# EAGLE design base_pcb_328 (EAGLE 7.2.0)

## Sheet 1 of 3
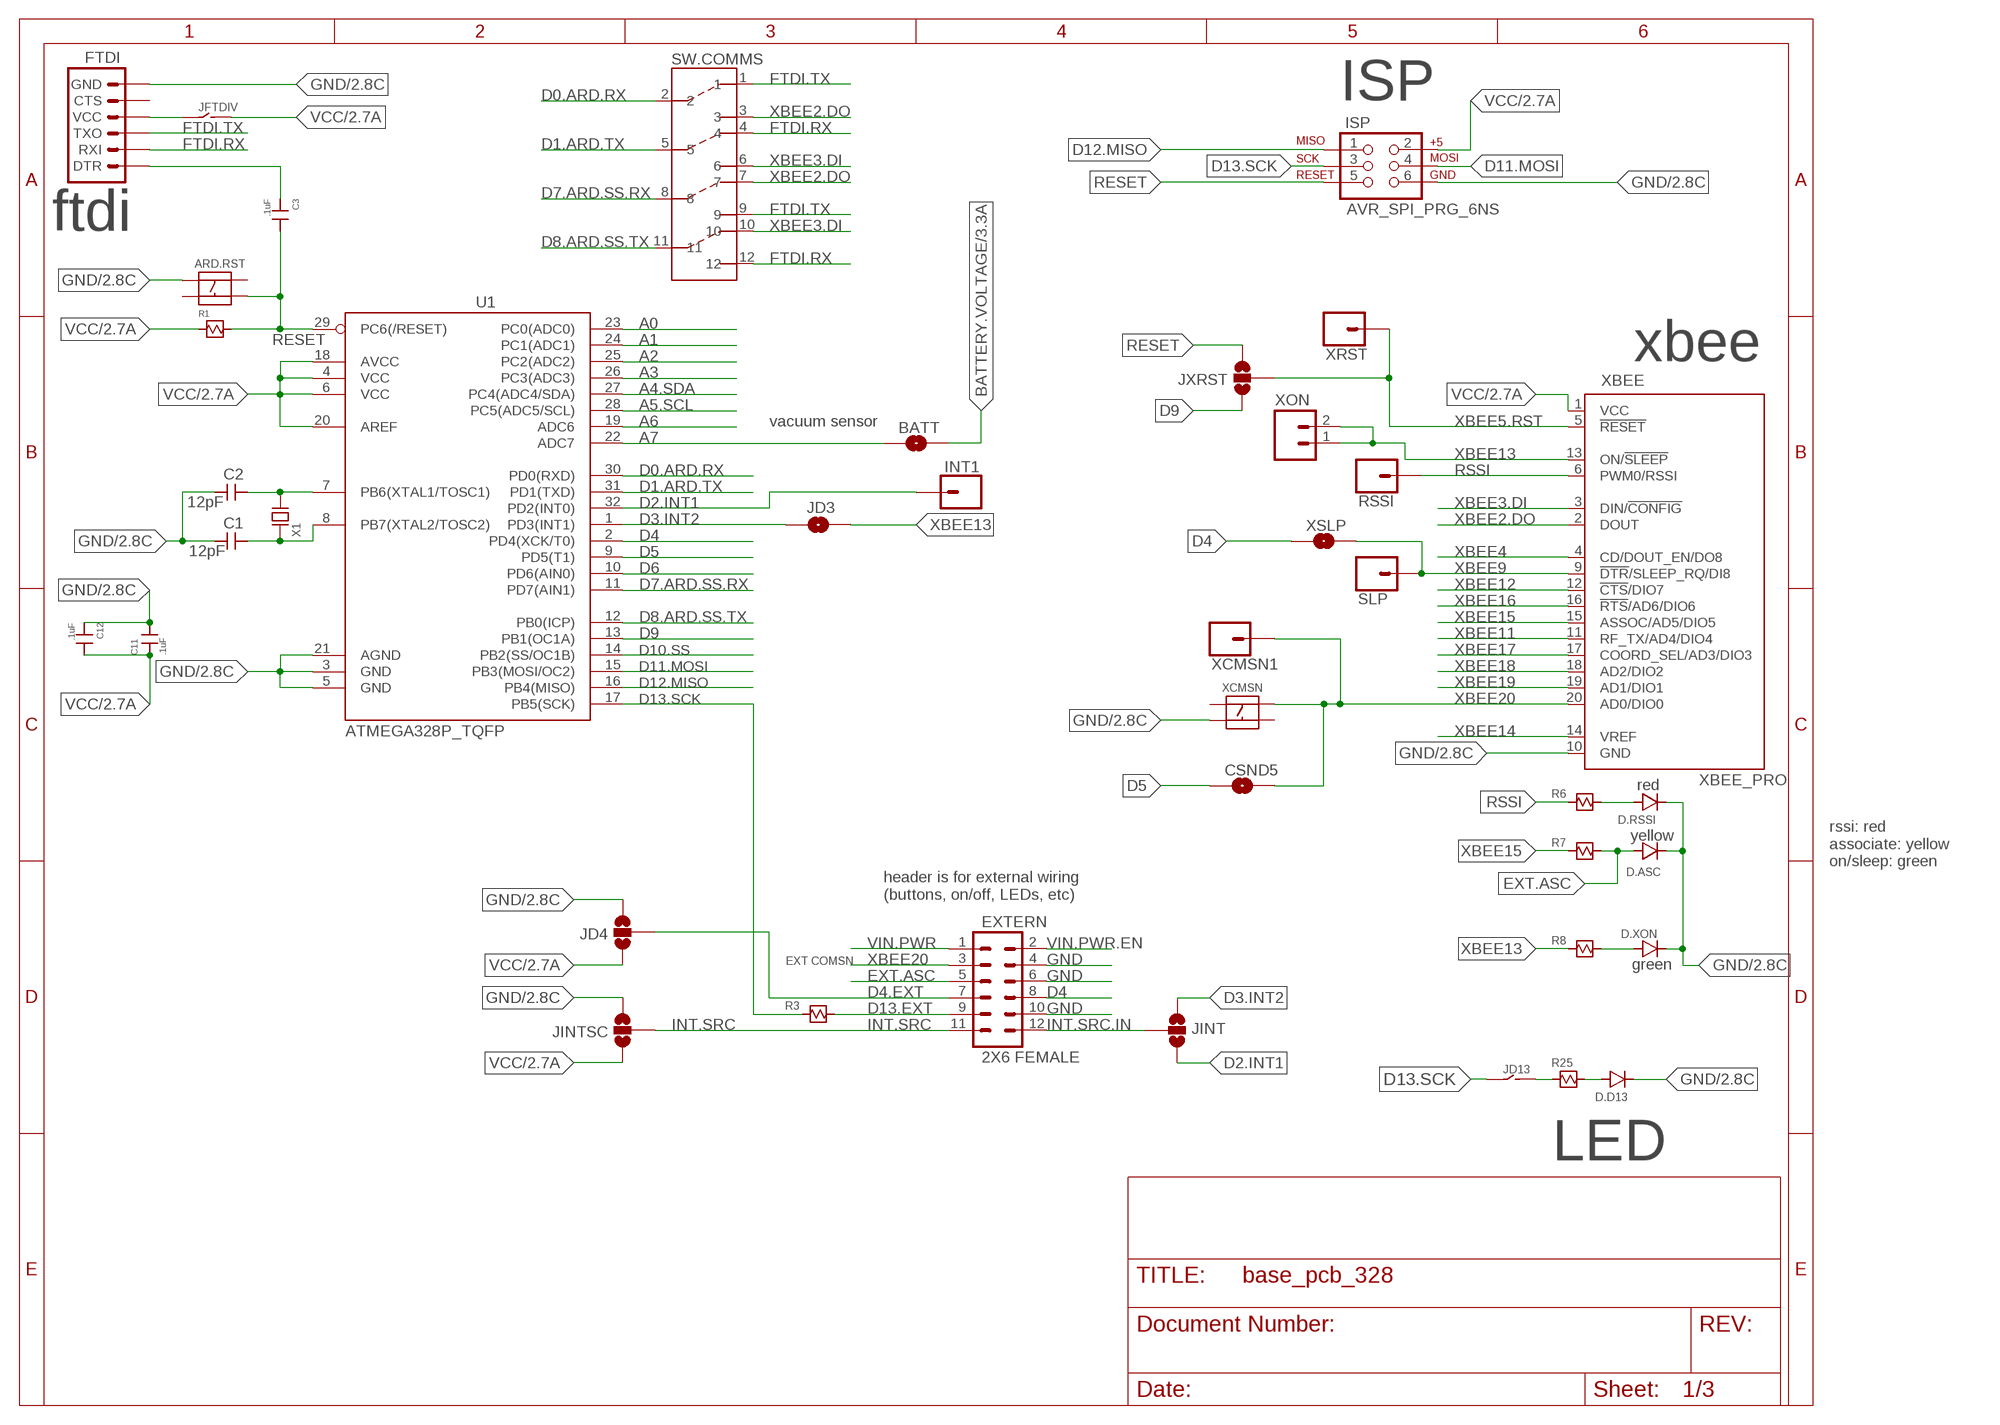
[diagram p0: schematic, sheet 1]

### Parts
ARD.RST  C&K_PUSHBUTTON_SMALL_MOM_SPST_SMD  [C&K_PUSHBUTTON_MOM_SMALL_SPST_SMD]
BATT  JUMPER-PAD-2-NOYES_SILK  [PAD-JUMPER-2-NO_YES_SILK]
C1  12pF  0603_CAPACITOR  [0603_CAPACITOR]
C2  12pF  0603_CAPACITOR  [0603_CAPACITOR]
C3  .1uF  0603_CAPACITOR  [0603_CAPACITOR]
C11  .1uF  0402_CAPACITOR  [0402_CAPACITOR]
C12  .1uF  0402_CAPACITOR  [0402_CAPACITOR]
CSND5  JUMPER-PAD-2-NOYES_SILK  [PAD-JUMPER-2-NO_YES_SILK]
D.ASC  0603_LED  [0603_LED]
D.D13  0603_LED  [0603_LED]
D.RSSI  0603_LED  [0603_LED]
D.XON  0603_LED  [0603_LED]
EXTERN  2X6 FEMALE  M06X2PTH_FEMALE  [2X6]
FTDI  ARDUINO_SERIAL_PROGRAMPTH  [1X06]
INT1  M01PTH  [1X01]
ISP  AVR_SPI_PRG_6NS  [2X3-NS]
JD3  JUMPER-PAD-2-NOYES_SILK  [PAD-JUMPER-2-NO_YES_SILK]
JD4  JUMPER-PAD-3-NOYES_SILK  [PAD-JUMPER-3-NO_YES_SILK]
JD13  JUMPER_2WAY_.1"_TH  [JUMPER_2WAY_.1"_TH]
JFTDIV  JUMPER_2WAY_.1"_TH  [JUMPER_2WAY_.1"_TH]
JINT  JUMPER-PAD-3-NOYES_SILK  [PAD-JUMPER-3-NO_YES_SILK]
JINTSC  JUMPER-PAD-3-NOYES_SILK  [PAD-JUMPER-3-NO_YES_SILK]
JXRST  JUMPER-PAD-3-NOYES_SILK  [PAD-JUMPER-3-NO_YES_SILK]
R1  0603_RESISTOR  [0603_RESISTOR]
R3  0603_RESISTOR  [0603_RESISTOR]
R6  0603_RESISTOR  [0603_RESISTOR]
R7  0603_RESISTOR  [0603_RESISTOR]
R8  0603_RESISTOR  [0603_RESISTOR]
R25  0603_RESISTOR  [0603_RESISTOR]
RSSI  M01PTH  [1X01]
SLP  M01PTH  [1X01]
SW.COMMS  COPAL_4PDT_SLIDE_SWITCH_TH  [COPAL_4PDT_SLIDE_SWITCH]
U1  ATMEGA328P_TQFP  [TQFP32-08]
X1  ABRACON_ABM3-16.000MHZ-D2Y-T_OSCILLATOR  [ABRACON_ABM3-16.000MHZ-D2Y-T_OSCILLATOR]
XBEE  XBEE_PRO  [XBEE_PRO]
XCMSN  C&K_PUSHBUTTON_SMALL_MOM_SPST_SMD  [C&K_PUSHBUTTON_MOM_SMALL_SPST_SMD]
XCMSN1  M01PTH  [1X01]
XON  M02PTH  [1X02]
XRST  M01PTH  [1X01]
XSLP  JUMPER-PAD-2-NOYES_SILK  [PAD-JUMPER-2-NO_YES_SILK]

### Nets
A0: U1.23(PC0(ADC0)) ; also sheet 2
A1: U1.24(PC1(ADC1)) ; also sheet 2
A2: U1.25(PC2(ADC2)) ; also sheet 2
A3: U1.26(PC3(ADC3)) ; also sheet 2
A4.SDA: U1.27(PC4(ADC4/SDA)) ; also sheet 2
A5.SCL: U1.28(PC5(ADC5/SCL)) ; also sheet 2
A6: U1.19(ADC6) ; also sheet 2
A7: BATT.1 U1.22(ADC7)
BATTERY.VOLTAGE: BATT.2 ; also sheet 3
D0.ARD.RX: SW.COMMS.2 U1.30(PD0(RXD))
D1.ARD.TX: SW.COMMS.5 U1.31(PD1(TXD))
D2.INT1: INT1.1 JINT.3 U1.32(PD2(INT0)) ; also sheet 2
D3.INT2: JD3.1 JINT.1 U1.1(PD3(INT1)) ; also sheet 2
D4: EXTERN.8 U1.2(PD4(XCK/T0)) XSLP.1 ; also sheet 2
D4.EXT: EXTERN.7 JD4.2
D5: CSND5.1 U1.9(PD5(T1)) ; also sheet 2
D6: U1.10(PD6(AIN0)) ; also sheet 2
D7.ARD.SS.RX: SW.COMMS.8 U1.11(PD7(AIN1))
D8.ARD.SS.TX: SW.COMMS.11 U1.12(PB0(ICP)) ; also sheet 2
D9: JXRST.1 U1.13(PB1(OC1A)) ; also sheet 2,3
D10.SS: U1.14(PB2(SS/OC1B)) ; also sheet 2
D11.MOSI: ISP.4 U1.15(PB3(MOSI/OC2)) ; also sheet 2
D12.MISO: ISP.1 U1.16(PB4(MISO)) ; also sheet 2
D13.EXT: EXTERN.9 R3.2
D13.SCK: ISP.3 JD13.P$1 R3.1 U1.17(PB5(SCK)) ; also sheet 2
EXT.ASC: D.ASC.1 EXTERN.5 R7.2
FTDI.RX: FTDI.2(RXI) SW.COMMS.4 SW.COMMS.12
FTDI.TX: FTDI.3(TXO) SW.COMMS.1 SW.COMMS.9
GND: ARD.RST.1 C1.2 C2.2 C11.2 C12.1 D.ASC.2 D.D13.2 D.RSSI.2 D.XON.2 EXTERN.4 EXTERN.6 EXTERN.10 FTDI.6(GND) ISP.6 JD4.3 JINTSC.3 U1.3(GND) U1.5(GND) U1.21(AGND) XBEE.10(GND) XCMSN.3 ; also sheet 2,3
INT.SRC: EXTERN.11 JINTSC.2
INT.SRC.IN: EXTERN.12 JINT.2
N$1: C2.1 U1.7(PB6(XTAL1/TOSC1)) X1.P$2
N$2: C1.1 U1.8(PB7(XTAL2/TOSC2)) X1.P$1
N$3: C3.1 FTDI.1(DTR)
N$5: D.D13.1 R25.2
N$6: JD13.P$2 R25.1
N$24: D.RSSI.1 R6.2
N$33: D.XON.1 R8.2
RESET: ARD.RST.4 C3.2 ISP.5 JXRST.3 R1.2 U1.29(PC6(/RESET))
RSSI: R6.1 RSSI.1 XBEE.6(PWM0/RSSI) ; also sheet 2
VCC: C11.1 C12.2 ISP.2 JD4.1 JFTDIV.P$2 JINTSC.1 R1.1 U1.4(VCC) U1.6(VCC) U1.18(AVCC) U1.20(AREF) XBEE.1(VCC) ; also sheet 2,3
VCC.FTDI: FTDI.4(VCC) JFTDIV.P$1
VIN.PWR: EXTERN.1 ; also sheet 2,3
VIN.PWR.EN: EXTERN.2 ; also sheet 3
XBEE2.DO: SW.COMMS.3 SW.COMMS.7 XBEE.2(DOUT) ; also sheet 2
XBEE3.DI: SW.COMMS.6 SW.COMMS.10 XBEE.3(DIN/!CONFIG) ; also sheet 2
XBEE4: XBEE.4(CD/DOUT_EN/DO8) ; also sheet 2
XBEE5.RST: JXRST.2 XBEE.5(!RESET) XRST.1 ; also sheet 2
XBEE9: SLP.1 XBEE.9(!DTR!/SLEEP_RQ/DI8) XSLP.2 ; also sheet 2
XBEE11: XBEE.11(RF_TX/AD4/DIO4) ; also sheet 2
XBEE12: XBEE.12(!CTS!/DIO7) ; also sheet 2
XBEE13: JD3.2 R8.1 XBEE.13(ON/!SLEEP) XON.1 XON.2 ; also sheet 2
XBEE14: XBEE.14(VREF) ; also sheet 2
XBEE15: R7.1 XBEE.15(ASSOC/AD5/DIO5) ; also sheet 2
XBEE16: XBEE.16(!RTS!/AD6/DIO6) ; also sheet 2
XBEE17: XBEE.17(COORD_SEL/AD3/DIO3) ; also sheet 2
XBEE18: XBEE.18(AD2/DIO2) ; also sheet 2
XBEE19: XBEE.19(AD1/DIO1) ; also sheet 2
XBEE20: CSND5.2 EXTERN.3 XBEE.20(AD0/DIO0) XCMSN1.1 XCMSN.2 ; also sheet 2
Unconnected: ARD.RST.2 ARD.RST.3 FTDI.5(CTS) XCMSN.1 XCMSN.4

### Notes on the sheet
- ISP
- ftdi
- xbee
- vacuum sensor
- red
- yellow
- rssi: red
  associate: yellow
  on/sleep: green
- header is for external wiring
  (buttons, on/off, LEDs, etc)
- EXT COMSN
- green
- LED

## Sheet 2 of 3
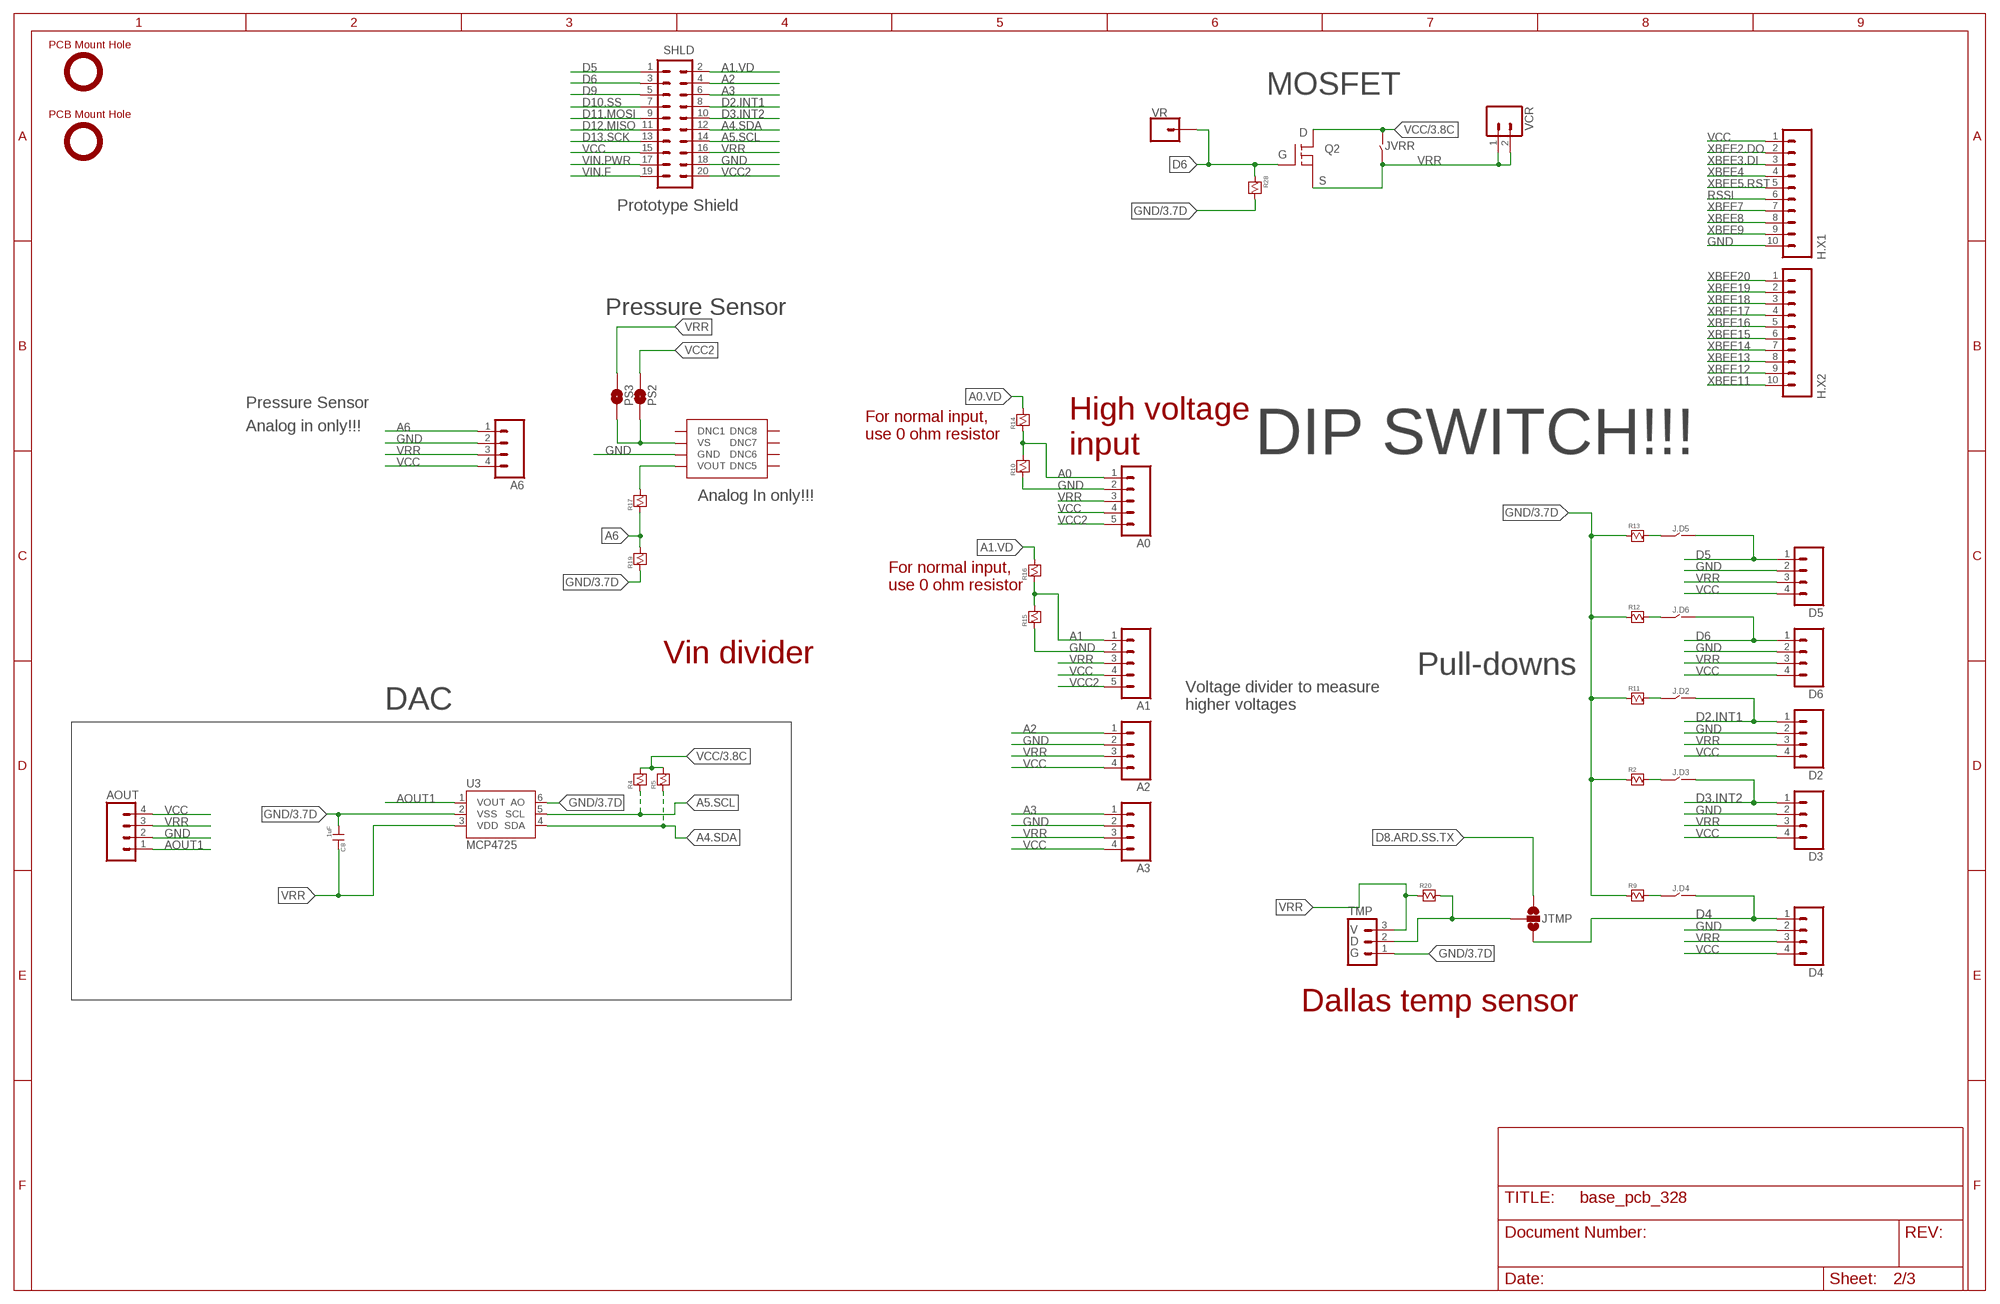
[diagram p1: schematic, sheet 2]

### Parts
A0  M05PTH  [1X05]
A1  M05PTH  [1X05]
A2  M04PTH  [1X04]
A3  M04PTH  [1X04]
A6  M04PTH  [1X04]
AOUT  M04PTH  [1X04]
C8  .1uF  0603_CAPACITOR  [0603_CAPACITOR]
D2  M04PTH  [1X04]
D3  M04PTH  [1X04]
D4  M04PTH  [1X04]
D5  M04PTH  [1X04]
D6  M04PTH  [1X04]
H.X1  M10NO_SILK_PTH_FEMALE  [1X10_NO_SILK]
H.X2  M10NO_SILK_PTH_FEMALE  [1X10_NO_SILK]
J.D2  JUMPER_2WAY_.1"_TH  [JUMPER_2WAY_.1"_TH]
J.D3  JUMPER_2WAY_.1"_TH  [JUMPER_2WAY_.1"_TH]
J.D4  JUMPER_2WAY_.1"_TH  [JUMPER_2WAY_.1"_TH]
J.D5  JUMPER_2WAY_.1"_TH  [JUMPER_2WAY_.1"_TH]
J.D6  JUMPER_2WAY_.1"_TH  [JUMPER_2WAY_.1"_TH]
JTMP  JUMPER-PAD-3-NOYES_SILK  [PAD-JUMPER-3-NO_YES_SILK]
JVRR  JUMPER_2WAY_.1"_TH  [JUMPER_2WAY_.1"_TH]
PS2  JUMPER-PAD-2-NOYES_SILK  [PAD-JUMPER-2-NO_YES_SILK]
PS3  JUMPER-PAD-2-NOYES_SILK  [PAD-JUMPER-2-NO_YES_SILK]
Q2  INFINEON_MOSFET_NCH  [INFINEON_MOSFET_NCH_SMD]
R2  0603_RESISTOR  [0603_RESISTOR]
R4  0603_RESISTOR  [0603_RESISTOR]
R5  0603_RESISTOR  [0603_RESISTOR]
R9  0603_RESISTOR  [0603_RESISTOR]
R10  0603_RESISTOR  [0603_RESISTOR]
R11  0603_RESISTOR  [0603_RESISTOR]
R12  0603_RESISTOR  [0603_RESISTOR]
R13  0603_RESISTOR  [0603_RESISTOR]
R14  0603_RESISTOR  [0603_RESISTOR]
R15  0603_RESISTOR  [0603_RESISTOR]
R16  0603_RESISTOR  [0603_RESISTOR]
R17  0603_RESISTOR  [0603_RESISTOR]
R19  0603_RESISTOR  [0603_RESISTOR]
R20  0603_RESISTOR  [0603_RESISTOR]
R28  0603_RESISTOR  [0603_RESISTOR]
SHLD  M10X2  [2X10]
TMP  M03PTH  [1X03]
U3  MCP4725  MCP4725SOT-23  [SOT23-6]
U$9  MPXV6115VC6U  [MPXV6115VC6U]
U$13  PCB_HOLE  [PCB_HOLE]
U$14  PCB_HOLE  [PCB_HOLE]
VCR  M02PTH  [1X02]
VR  M01PTH  [1X01]

### Nets
A0: A0.1 R10.2 R14.1 ; also sheet 1
A0.VD: R14.2 ; also sheet 3
A1: A1.1 R15.2 R16.1 ; also sheet 1
A1.VD: R16.2 SHLD.2
A2: A2.1 SHLD.4 ; also sheet 1
A3: A3.1 SHLD.6 ; also sheet 1
A4.SDA: R5.1 SHLD.12 U3.4(SDA) ; also sheet 1
A5.SCL: R4.1 SHLD.14 U3.5(SCL) ; also sheet 1
A6: A6.1 R17.1 R19.2 ; also sheet 1
A6.IN: R17.2 U$9.4(VOUT)
AOUT1: AOUT.1 U3.1(VOUT)
D2.INT1: D2.1 J.D2.P$2 SHLD.8 ; also sheet 1
D3.INT2: D3.1 J.D3.P$2 SHLD.10 ; also sheet 1
D4: D4.1 J.D4.P$2 JTMP.3 ; also sheet 1
D5: D5.1 J.D5.P$2 SHLD.1 ; also sheet 1
D6: D6.1 J.D6.P$2 Q2.G R28.1 SHLD.3 VR.1 ; also sheet 1
D8.ARD.SS.TX: JTMP.1 ; also sheet 1
D9: SHLD.5 ; also sheet 1,3
D10.SS: SHLD.7 ; also sheet 1
D11.MOSI: SHLD.9 ; also sheet 1
D12.MISO: SHLD.11 ; also sheet 1
D13.SCK: SHLD.13 ; also sheet 1
GND: A0.2 A1.2 A2.2 A3.2 A6.2 AOUT.2 C8.1 D2.2 D3.2 D4.2 D5.2 D6.2 H.X1.10 R2.1 R9.1 R10.1 R11.1 R12.1 R13.1 R15.1 R19.1 R28.2 SHLD.18 TMP.1 U3.2(VSS) U3.6(AO) U$9.3(GND) ; also sheet 1,3
N$7: JTMP.2 R20.2 TMP.2
N$13: PS2.1 PS3.1 U$9.2(VS)
N$20: J.D3.P$1 R2.2
N$21: J.D6.P$1 R12.2
N$22: J.D5.P$1 R13.2
N$25: J.D2.P$1 R11.2
N$34: J.D4.P$1 R9.2
RSSI: H.X1.6 ; also sheet 1
VCC: A0.4 A1.4 A2.4 A3.4 A6.4 AOUT.4 D2.4 D3.4 D4.4 D5.4 D6.4 H.X1.1 JVRR.P$2 Q2.D R4.2 R5.2 SHLD.15 ; also sheet 1,3
VCC2: A0.5 A1.5 PS2.2 SHLD.20 ; also sheet 3
VIN.F: SHLD.19 ; also sheet 3
VIN.PWR: SHLD.17 ; also sheet 1,3
VRR: A0.3 A1.3 A2.3 A3.3 A6.3 AOUT.3 C8.2 D2.3 D3.3 D4.3 D5.3 D6.3 JVRR.P$1 PS3.2 Q2.S R20.1 SHLD.16 TMP.3 U3.3(VDD) VCR.1 VCR.2 ; also sheet 3
XBEE2.DO: H.X1.2 ; also sheet 1
XBEE3.DI: H.X1.3 ; also sheet 1
XBEE4: H.X1.4 ; also sheet 1
XBEE5.RST: H.X1.5 ; also sheet 1
XBEE7: H.X1.7
XBEE8: H.X1.8
XBEE9: H.X1.9 ; also sheet 1
XBEE11: H.X2.10 ; also sheet 1
XBEE12: H.X2.9 ; also sheet 1
XBEE13: H.X2.8 ; also sheet 1
XBEE14: H.X2.7 ; also sheet 1
XBEE15: H.X2.6 ; also sheet 1
XBEE16: H.X2.5 ; also sheet 1
XBEE17: H.X2.4 ; also sheet 1
XBEE18: H.X2.3 ; also sheet 1
XBEE19: H.X2.2 ; also sheet 1
XBEE20: H.X2.1 ; also sheet 1
Unconnected: U$9.1(DNC1) U$9.5(DNC5) U$9.6(DNC6) U$9.7(DNC7) U$9.8(DNC8)

### Notes on the sheet
- MOSFET
- Q2
- Prototype Shield
- Pressure Sensor
- Pressure Sensor
- Analog in only!!!
- For normal input, 
  use 0 ohm resistor
- High voltage 
  input
- DIP SWITCH!!!
- Analog In only!!!
- For normal input, 
  use 0 ohm resistor
- Vin divider
- Pull-downs
- DAC
- Voltage divider to measure 
  higher voltages
- V
- D
- G
- Dallas temp sensor

## Sheet 3 of 3
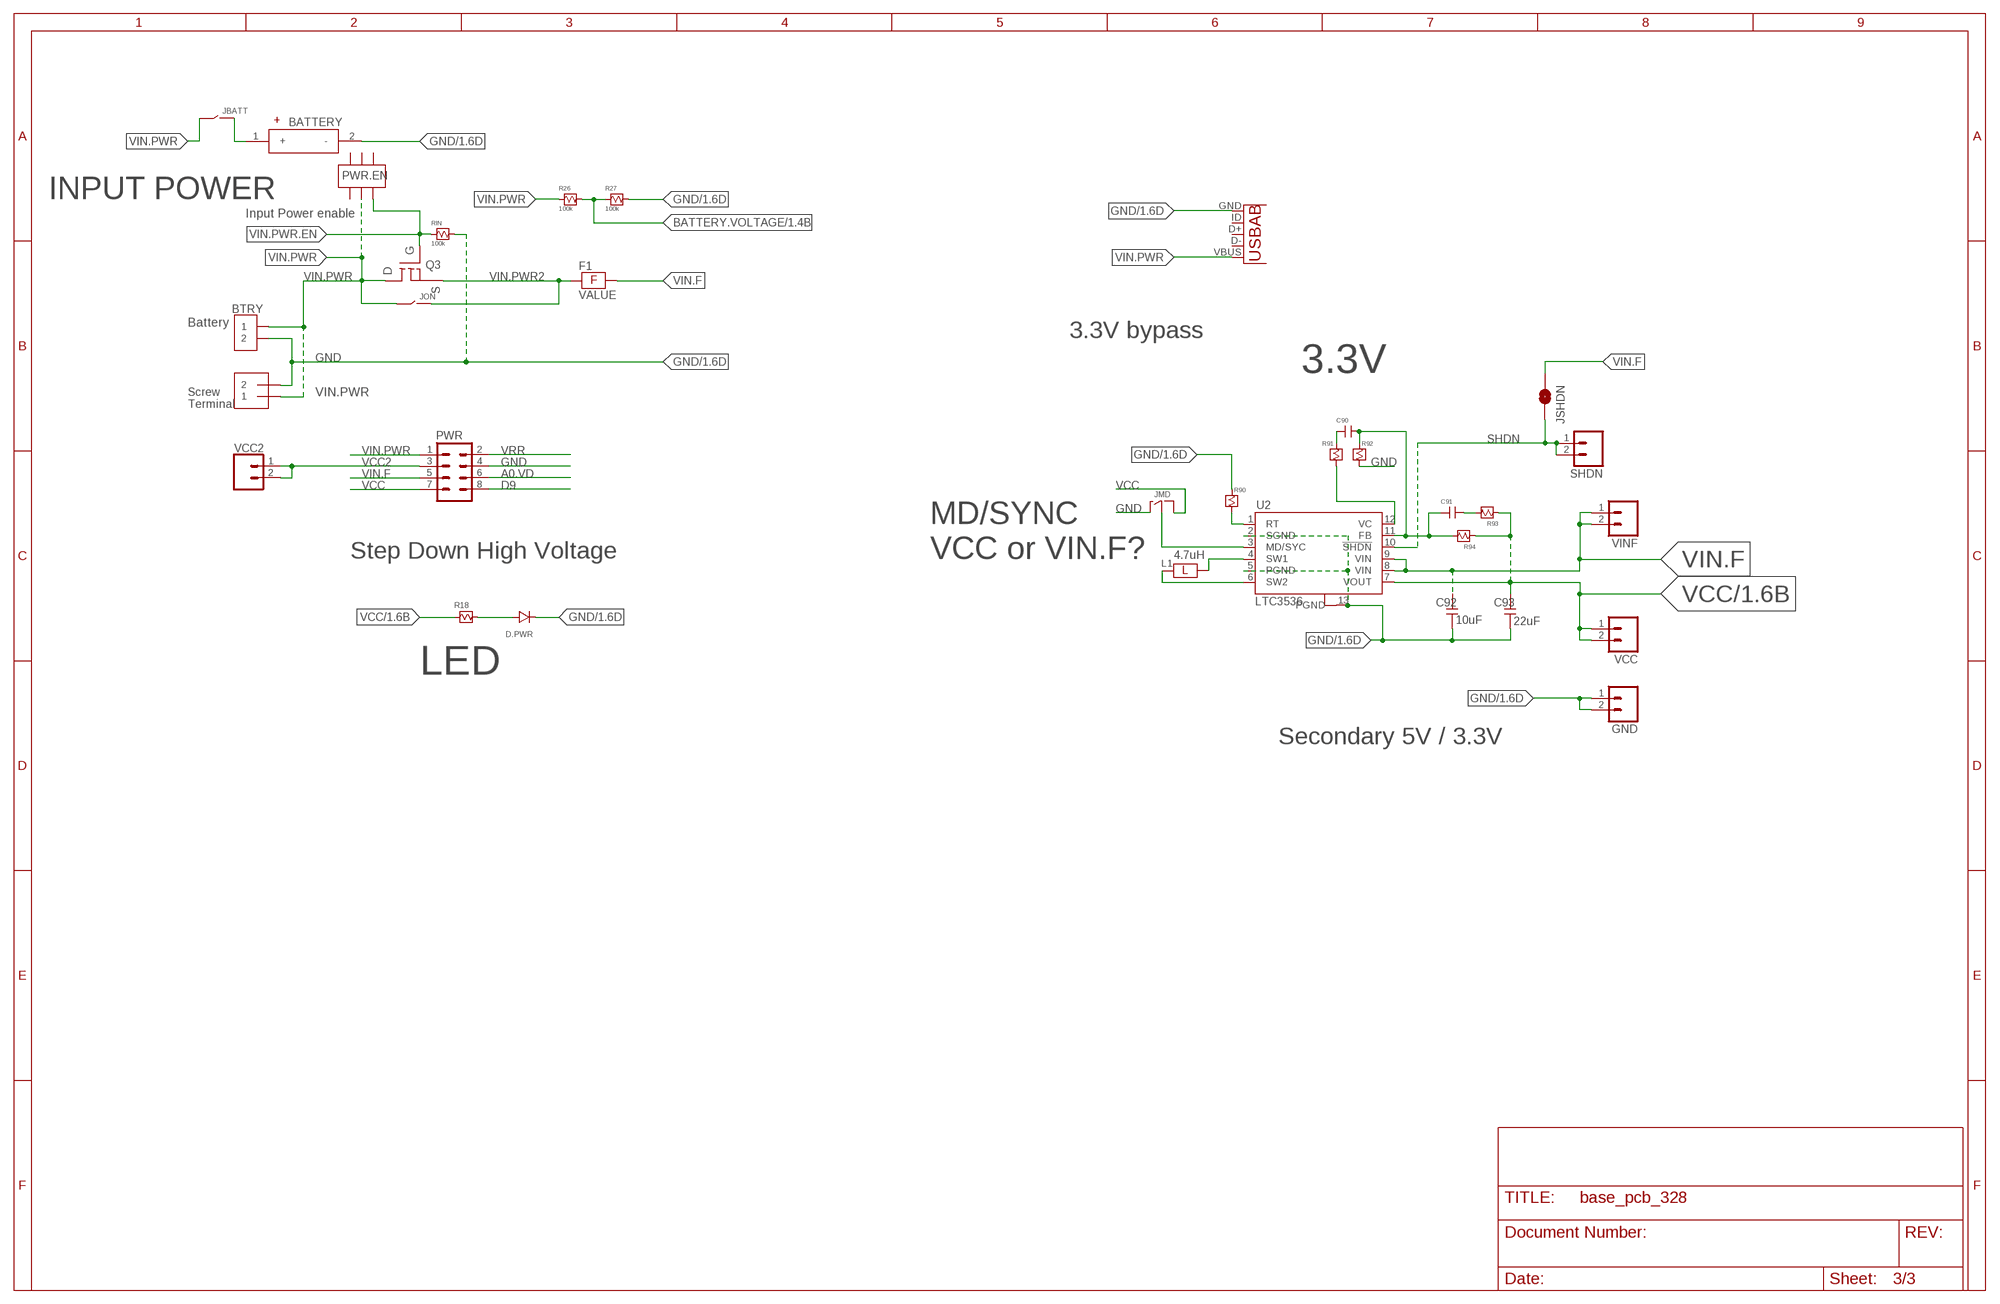
[diagram p2: schematic, sheet 3]

### Parts
5V  USB-AB  [USB-AB-MICRO-SMD]
BATTERY  BATTERY_HOLDER_18650  [BATTERY_HOLDER_18650]
BTRY  MOLEX_2PIN_LOCKING_TH  [MOLEX_2PIN_LOCKING_TH]
C90  0603_CAPACITOR  [0603_CAPACITOR]
C91  0603_CAPACITOR  [0603_CAPACITOR]
C92  10uF  0805_CAPACITOR  [0805_CAPACITOR]
C93  22uF  0805_CAPACITOR  [0805_CAPACITOR]
D.PWR  0603_LED  [0603_LED]
F1  PTC_FUSE_PTC_1206  [BEL_FUSE_PTC_FUSE_1206]
GND  M02PTH  [1X02]
INPUT.PWR  1X2-3.5MM  [1X2-3.5MM]
JBATT  JUMPER_2WAY_.1"_TH  [JUMPER_2WAY_.1"_TH]
JMD  JUMPER_3WAY_.1"_TH  [JUMPER_3WAY_.1"_TH]
JON  JUMPER_2WAY_.1"_TH  [JUMPER_2WAY_.1"_TH]
JSHDN  JUMPER-PAD-2-NOYES_SILK  [PAD-JUMPER-2-NO_YES_SILK]
L1  4.7uH  BOURNS_INDUCTOR_SMD  [BOURNS_INDUCTOR_SMD]
PWR  M04X2  [2X4]
PWR.EN  C&K_DPDT_SLIDE_SWITCH_SMD_HIDDEN_PADS  [C&K_SLIDE_SWITCH_DPDT_SMD_HIDDEN_PADS]
Q3  INFINEON_MOSFET_NCH  [INFINEON_MOSFET_NCH_SMD]
R18  0603_RESISTOR  [0603_RESISTOR]
R26  100k  0603_RESISTOR  [0603_RESISTOR]
R27  100k  0603_RESISTOR  [0603_RESISTOR]
R90  0603_RESISTOR  [0603_RESISTOR]
R91  0603_RESISTOR  [0603_RESISTOR]
R92  0603_RESISTOR  [0603_RESISTOR]
R93  0603_RESISTOR  [0603_RESISTOR]
R94  0603_RESISTOR  [0603_RESISTOR]
RIN  100k  0603_RESISTOR  [0603_RESISTOR]
SHDN  M02PTH  [1X02]
U2  LTC3536_ADJ_12PIN  [LTC3536_ADJ_12PIN]
VCC  M02PTH  [1X02]
VCC2  M02PTH  [1X02]
VINF  M02PTH  [1X02]

### Nets
A0.VD: PWR.6 ; also sheet 2
BATTERY.VOLTAGE: R26.2 R27.1 ; also sheet 1
D9: PWR.8 ; also sheet 1,2
GND: 5V.GND BATTERY.2(-) BTRY.2 C92.1 C93.1 D.PWR.2 GND.1 GND.2 INPUT.PWR.2 JMD.P$3 PWR.4 R27.2 R90.2 R92.1 RIN.2 U2.2(SGND) U2.5(PGND) U2.13(PGND) ; also sheet 1,2
N$4: BATTERY.1(+) JBATT.P$2
N$12: L1.P$2 U2.4(SW1)
N$16: D.PWR.1 R18.2
N$23: L1.P$1 U2.6(SW2)
N$26: R90.1 U2.1(RT)
N$27: C90.2 C91.1 R92.2 R94.2 U2.11(FB)
N$28: C90.1 R91.2
N$29: R91.1 U2.12(VC)
N$30: C91.2 R93.2
N$31: JMD.P$2 U2.3(MD/SYC)
SHDN: JSHDN.2 SHDN.1 SHDN.2 U2.10(!SHDN)
VCC: C93.2 JMD.P$1 PWR.7 R18.1 R93.1 R94.1 U2.7(VOUT) VCC.1 VCC.2 ; also sheet 1,2
VCC2: PWR.3 VCC2.1 VCC2.2 ; also sheet 2
VIN.F: C92.2 F1.P$2 JSHDN.1 PWR.5 U2.8(VIN) U2.9(VIN) VINF.1 VINF.2 ; also sheet 2
VIN.PWR: 5V.VBUS BTRY.1 INPUT.PWR.1 JBATT.P$1 JON.P$1 PWR.1 PWR.EN.5 Q3.D R26.1 ; also sheet 1,2
VIN.PWR2: F1.P$1 JON.P$2 Q3.S
VIN.PWR.EN: PWR.EN.4 Q3.G RIN.1 ; also sheet 1
VRR: PWR.2 ; also sheet 2
Unconnected: 5V.D+ 5V.D- 5V.ID(USBID) PWR.EN.1 PWR.EN.2 PWR.EN.3 PWR.EN.6

### Notes on the sheet
- BATTERY
- INPUT POWER
- Input Power enable
- Q3
- Battery
- 3.3V bypass
- 3.3V
- Screw
  Terminal
- Step Down High Voltage
- MD/SYNC
  VCC or VIN.F?
- 4.7uH
- LED
- Secondary 5V / 3.3V

## Library data of the parts
5V = SparkFun-Connectors:USB-AB: This is a USB AB connector that is compatible with USB OTG. i.e. this connector can serve as a host or device
A0 A1 = SparkFun-Connectors:M05: Header 5 Standard 5-pin 0.1" header. Use with straight break away headers (SKU : PRT-00116), right angle break away headers (PRT-00553), swiss pins (PRT-00743), machine pins (PRT-00117), and female headers (PRT-00115). Molex polarized connector foot print use with SKU : PRT-08230 with associated crimp pins and housings.
A2 A3 A6 AOUT D2-D6 = SparkFun-Connectors:M04: Header 4 Standard 4-pin 0.1" header. Use with straight break away headers (SKU : PRT-00116), right angle break away headers (PRT-00553), swiss pins (PRT-00743), machine pins (PRT-00117), and female headers (PRT-00115). Molex polarized connector foot print use with SKU : PRT-08231 with associated crimp pins and housings. 1MM SMD Version SKU: PRT-10208
ARD.RST XCMSN = Heath_control:C&K_PUSHBUTTON_SMALL_MOM_SPST_SMD: C&K: KMR742NG LFS Digikey: CKN10689CT-ND Description: SWITCH TACTILE SPST-NO 50MA 32V
BATT CSND5 JD3 JSHDN PS2 PS3 XSLP = SparkFun-Passives:JUMPER-PAD-2-NO
BATTERY = Heath_hardware:BATTERY_HOLDER_18650: Digikey: 36-1042-ND Keystone: 1042 Description: HOLDER BATTERY 1CELL 18650 SMD
BTRY = Heath_connectors:MOLEX_2PIN_LOCKING_TH: 2pin locking through hole
C1-C3 C8 C90 C91 = Heath_components:0603_CAPACITOR
C11 C12 = Heath_components:0402_CAPACITOR
C92 C93 = Heath_components:0805_CAPACITOR: 0805 samsung capacitor
D.ASC D.D13 D.PWR D.RSSI D.XON = Heath_components:0603_LED
EXTERN = SparkFun-Connectors:M06X2; PROD_ID: CONN-12423
F1 = Heath_circuit_protection:PTC_FUSE_PTC_1206: PTC resettable fuse, Bel Fuse, 1206 footprint
FTDI = SparkFun-Connectors:ARDUINO_SERIAL_PROGRAM: FTDI connector footprints
GND SHDN VCC VCC2 VCR VINF XON = SparkFun-Connectors:M02: Standard 2-pin 0.1" header. Use with - straight break away headers ( PRT-00116) - right angle break away headers (PRT-00553) - swiss pins (PRT-00743) - machine pins (PRT-00117) - female headers (PRT-00115) Molex polarized connector foot print use with: PRT-08233 with associated crimp pins and housings. 2.54_SCREWTERM for use with PRT-10571. 3.5mm Screw Terminal footprints for PRT-08084 5mm Screw Terminal footprints for use with PRT-08432
H.X1 H.X2 = SparkFun-Connectors:M10: Header 10 Standard 10-pin 0.1" header. Use with straight break away headers (SKU : PRT-00116), right angle break away headers (PRT-00553), swiss pins (PRT-00743), machine pins (PRT-00117), and female headers (PRT-00115).; PROD_ID: CONN-11563
INPUT.PWR = adafruit:1X2: 3.5mm Terminal block http://www.ladyada.net/library/pcb/eaglelibrary.html
INT1 RSSI SLP VR XCMSN1 XRST = SparkFun-Connectors:M01: Header 1 Standard 1-pin 0.1" header. Use with straight break away headers (SKU : PRT-00116), right angle break away headers (PRT-00553), swiss pins (PRT-00743), machine pins (PRT-00117), and female headers (PRT-00115).
ISP = SparkFun-Connectors:AVR_SPI_PRG_6: AVR ISP 6 Pin This is the reduced ISP connector for AVR programming. Common on Arduino. This footprint will take up less PCB space and can be used with a 10-pin to 6-pin adapter such as SKU: BOB-08508 **Special note about "TEST_POINT" package. The stop mask is on the top side, so if you want your programming test points to be on the bottom of your board, make sure to place this package on the bottom side of the board. This also ensure that the orientation to program from the bottom side will be correct.
J.D2-J.D6 JBATT JD13 JFTDIV JON JVRR = Heath_passives:JUMPER_2WAY_.1"_TH
JD4 JINT JINTSC JTMP JXRST = SparkFun-Passives:JUMPER-PAD-3-NO
JMD = Heath_passives:JUMPER_3WAY_.1"_TH
L1 = Heath_components:BOURNS_INDUCTOR_SMD: bourns inductor, 2.2uH - 10uH +, smd
PWR = SparkFun-Connectors:M04X2: .1" header, two rows of four.
PWR.EN = Heath_control:C&K_DPDT_SLIDE_SWITCH_SMD_HIDDEN_PADS: C&K slide switch (hidden pads) Digikey PN: CKN10723CT-ND C&K PN: JS202011JCQN
Q2 Q3 = Heath_components:INFINEON_MOSFET_NCH: Infineon:IRLML6344TRPBF Digikey: IRLML6344TRPBFCT-ND Description: MOSFET N-CH 30V 5A SOT23
R1-R20 R25-R28 R90-R94 RIN = Heath_components:0603_RESISTOR: 0603 footprint
SHLD = SparkFun-Connectors:M10X2: This was SPECIALLY designed to be used with our Graphic LCD Backpack. Be sure you want to use this! It is not only staggered on each line of header holes, but IT IS ALSO offset of the center point of the top and bottom lines by 5 mil. This causes the headers to lock into place on the "standard" footprint on the LCD screen. The extra squares on the tdocu layer are there simply to reference other pins (if you were to actually populate a longer header than ten long - this is what we do with the backpacks).
SW.COMMS = Heath_control:COPAL_4PDT_SLIDE_SWITCH_TH: Copal:MFS401N-2-Z Digikey: 563-1568-ND Description: SWITCH SLIDE 4PDT 300MA 30V
TMP = SparkFun-Connectors:M03: Header 3 Standard 3-pin 0.1" header. Use with straight break away headers (SKU : PRT-00116), right angle break away headers (PRT-00553), swiss pins (PRT-00743), machine pins (PRT-00117), and female headers (PRT-00115). Molex polarized connector foot print use with SKU : PRT-08232 with associated crimp pins and housings.
U1 = SparkFun-DigitalIC:ATMEGA328P_TQFP; PROD_ID: IC-09069
U2 = Heath_power:LTC3536_ADJ_12PIN: LTC3536
U3 = SparkFun-AnalogIC:MCP4725: Microchip 12-bit I2C DAC, SOT23-6; PROD_ID: IC-08886
U$9 = Heath_sensors:MPXV6115VC6U: NXP: MPXV6115VC6U Digikey: MPXV6115VC6U-ND Description: SENSOR PRESSURE VACUUM -16.68PSI
U$13 U$14 = Heath_hardware:PCB_HOLE
X1 = GREENSEA_Signal_Quality:ABRACON_ABM3-16.000MHZ-D2Y-T_OSCILLATOR: Abracon: ABM3-16.000MHZ-D2Y-T Digikey: 535-10638-1-ND
XBEE = Heath_boards:XBEE_PRO: xbee pro

## Board
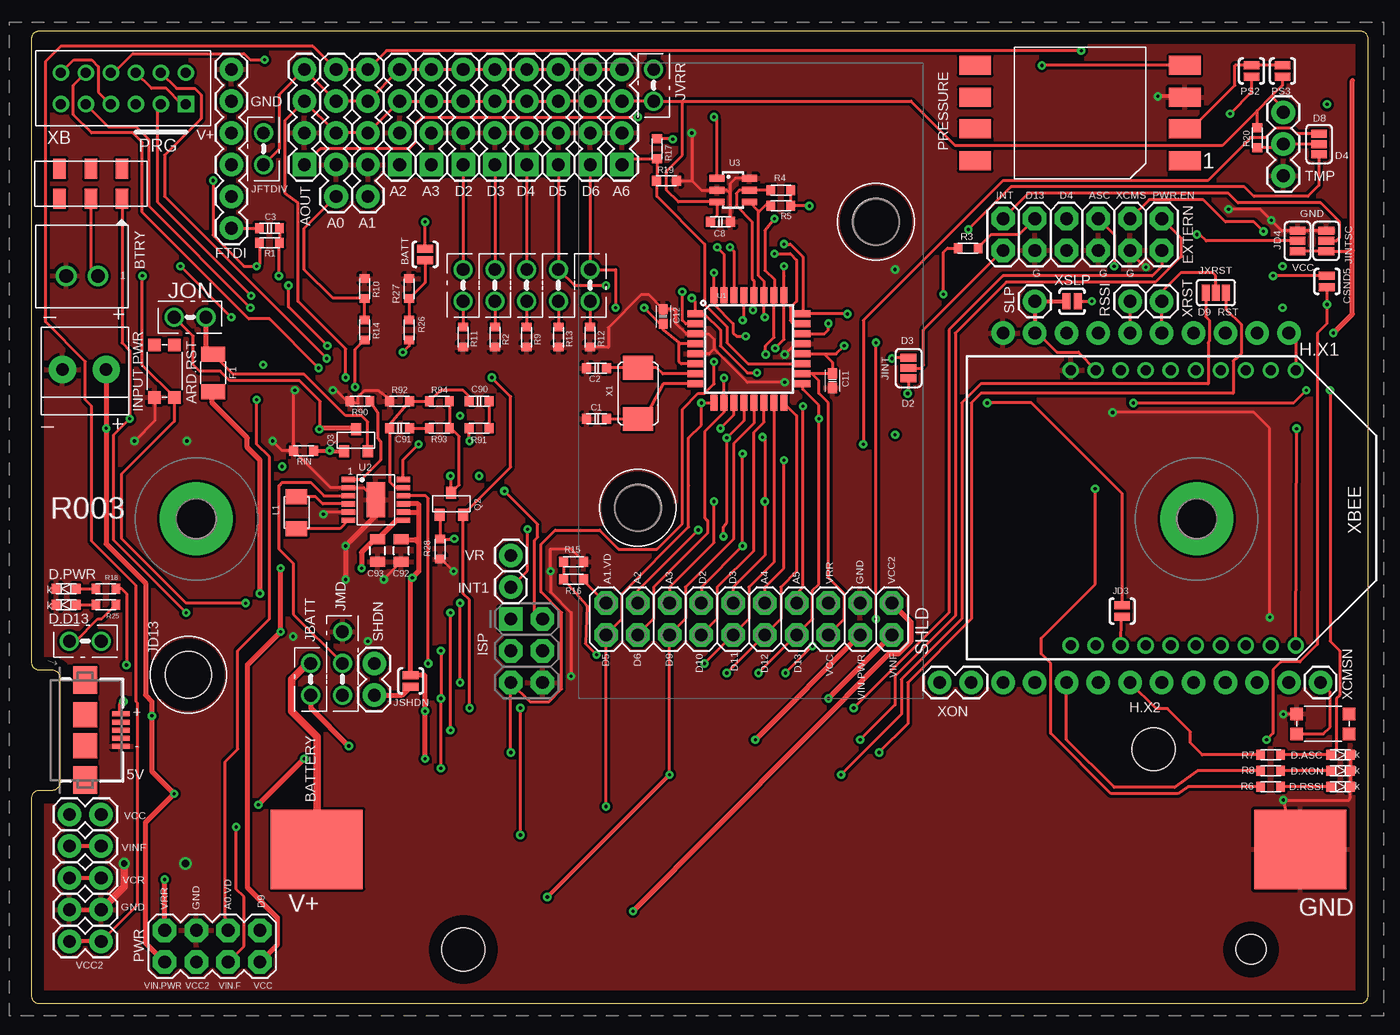
[diagram p3: board, top side]
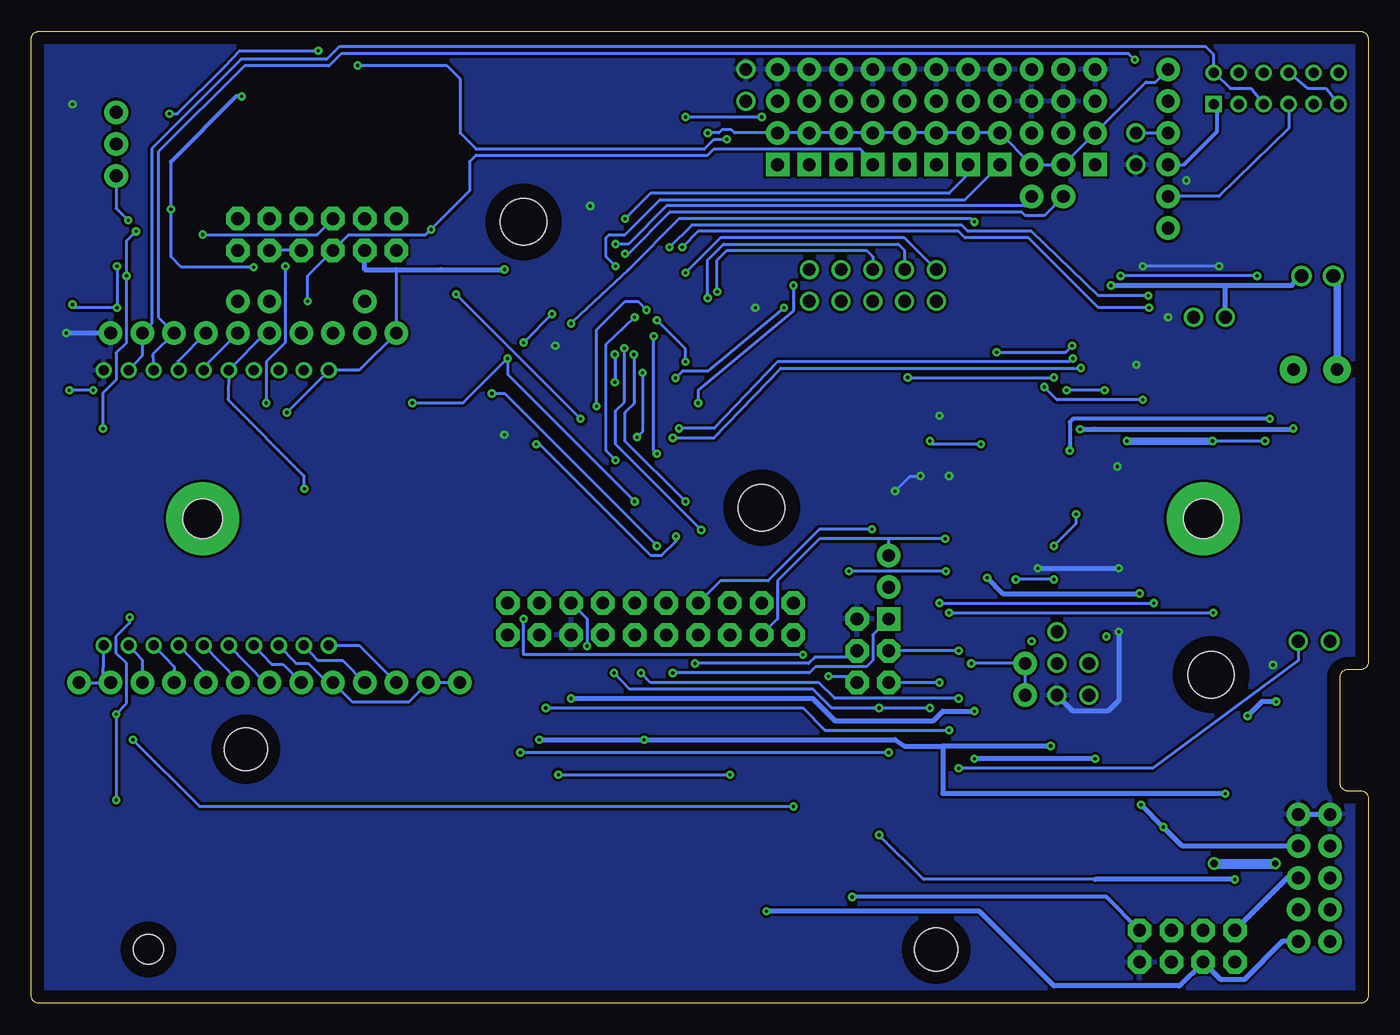
[diagram p4: board, bottom side, seen from below]

Size 106.93 x 77.72 mm. Coordinates in mm from the lower left corner, seen from the top.
Outline: 0,77.09 0,27.3 arc90 0.64,26.67 1.65,26.67 arc-90 2.29,26.04 2.29,17.65 arc-90 1.65,17.02 0.64,17.02 arc90 0,16.38 0,0.63 arc90 0.64,0 106.3,0 arc90 106.93,0.63 106.93,77.09 arc90 106.3,77.72 0.64,77.72 arc90 0,77.09
Copper layers (1*16): Top 0.035mm / dielectric 1.5mm / Bottom 0.035mm
Design rules "default *": minimum track width 10mil, minimum drill 24mil, track to track 8mil, track to pad 8mil, pad to pad 8mil, via to via 8mil, smd to smd 8mil, copper to edge 40mil, drill to drill 8mil, minimum pad ring 10mil, minimum via ring 8mil, stop-mask expansion 4mil, vias tented up to drill 11mil, thermal gap 10mil

### Footprints (pad centres in the part's own frame; a part is rotated, then mirrored left to right if it is on the bottom)
USB-AB-MICRO-SMD = smd 1.4 x 0.4: D+ 2.85,0; D- 2.85,0.65; GND 2.85,-1.3; ID 2.85,-0.65; VBUS 2.85,1.3 | smd 1.9 x 2: P$6 0,1.25; P$7 0,-1.25 | smd 1.9 x 2.2: P$8 0,4; P$9 0,-4
1X05 = drill 1.016 pad 1.88: 1 0,0; 2 2.54,0; 3 5.08,0; 4 7.62,0; 5 10.16,0
1X04 = drill 1.016 pad 1.88 square: 1 0,0 | drill 1.016 pad 1.88: 2 2.54,0; 3 5.08,0; 4 7.62,0
C&K_PUSHBUTTON_MOM_SMALL_SPST_SMD = smd 1 x 1: 1 -2.1,0.8; 2 2.1,0.8; 3 2.1,-0.8; 4 -2.1,-0.8
PAD-JUMPER-2-NO_YES_SILK = smd 0.635 x 1.27: 1 -0.45,0; 2 0.45,0
BATTERY_HOLDER_18650 = smd 7.34 x 6.35: 1 -39.33,0; 2 39.33,0 | hole 3.45: -27.6,-8; 27.6,8 | hole 2.39: 35.39,-8
MOLEX_2PIN_LOCKING_TH = drill 1.1: 1 1.27,0; 2 -1.27,0
0603_CAPACITOR = smd 0.7 x 0.8: 1 -0.8,0; 2 0.8,0
0402_CAPACITOR = smd 0.813 x 0.711: 1 -0.58,0; 2 0.58,0
0805_CAPACITOR = smd 0.8 x 1.2: 1 -0.9,0; 2 0.9,0
0603_LED = smd 0.7 x 0.8: 1 -0.8,0; 2 0.8,0
2X6 = drill 1.016 pad 1.88 octagon: 1 0,0; 2 0,2.54; 3 2.54,0; 4 2.54,2.54; 5 5.08,0; 6 5.08,2.54; 7 7.62,0; 8 7.62,2.54; 9 10.16,0; 10 10.16,2.54; 11 12.7,0; 12 12.7,2.54
BEL_FUSE_PTC_FUSE_1206 = smd 1.2 x 1.9: P$1 -1.5,0; P$2 1.5,0
1X06 = drill 1.016 pad 1.88: 1 0,0; 2 2.54,0; 3 5.08,0; 4 7.62,0; 5 10.16,0; 6 12.7,0
1X02 = drill 1.016 pad 1.88: 1 0,0; 2 2.54,0
1X10_NO_SILK = drill 1.016 pad 1.88: 1 0,0; 2 2.54,0; 3 5.08,0; 4 7.62,0; 5 10.16,0; 6 12.7,0; 7 15.24,0; 8 17.78,0; 9 20.32,0; 10 22.86,0
1X2-3.5MM = drill 1 pad 2.184: 1 1.8,0; 2 -1.7,0
1X01 = drill 1.016 pad 1.88: 1 0,0
2X3-NS = drill 1.016 pad 1.88 square: 1 -2.54,-1.27 | drill 1.016 pad 1.88 octagon: 2 -2.54,1.27; 3 0,-1.27; 4 0,1.27; 5 2.54,-1.27; 6 2.54,1.27
JUMPER_2WAY_.1"_TH = drill 1.016: P$1 -1.27,0; P$2 1.27,0
PAD-JUMPER-3-NO_YES_SILK = smd 0.635 x 1.27: 1 -0.813,0; 2 0,0; 3 0.813,0
JUMPER_3WAY_.1"_TH = drill 1.016: P$1 -2.54,0; P$2 0,0; P$3 2.54,0
BOURNS_INDUCTOR_SMD = smd 1.2 x 1.75: P$1 -1.275,0; P$2 1.275,0
2X4 = drill 1.016 pad 1.88 octagon: 1 -3.81,-1.27; 2 -3.81,1.27; 3 -1.27,-1.27; 4 -1.27,1.27; 5 1.27,-1.27; 6 1.27,1.27; 7 3.81,-1.27; 8 3.81,1.27
C&K_SLIDE_SWITCH_DPDT_SMD_HIDDEN_PADS = smd 1 x 1.6: 1 -2.5,1.2; 2 0,1.2; 3 2.5,1.2; 4 2.5,-1.2; 5 0,-1.2; 6 -2.5,-1.2
INFINEON_MOSFET_NCH_SMD = smd 0.802 x 0.972: D 0,0.885; G -0.95,-0.885; S 0.95,-0.885
0603_RESISTOR = smd 0.7 x 0.8: 1 -0.8,0; 2 0.8,0
2X10 = drill 1.016 pad 1.88 octagon: 1 -11.43,-1.27; 2 -11.43,1.27; 3 -8.89,-1.27; 4 -8.89,1.27; 5 -6.35,-1.27; 6 -6.35,1.27; 7 -3.81,-1.27; 8 -3.81,1.27; 9 -1.27,-1.27; 10 -1.27,1.27; 11 1.27,-1.27; 12 1.27,1.27; 13 3.81,-1.27; 14 3.81,1.27; 15 6.35,-1.27; 16 6.35,1.27; 17 8.89,-1.27; 18 8.89,1.27; 19 11.43,-1.27; 20 11.43,1.27
COPAL_4PDT_SLIDE_SWITCH = drill 0.8 square: 1 -5,1.25 | drill 0.8: 2 -3,1.25; 3 -1,1.25; 4 1,1.25; 5 3,1.25; 6 5,1.25; 7 -5,-1.25; 8 -3,-1.25; 9 -1,-1.25; 10 1,-1.25; 11 3,-1.25; 12 5,-1.25
1X03 = drill 1.016 pad 1.88: 1 0,0; 2 2.54,0; 3 5.08,0
TQFP32-08 = smd 1.27 x 0.559: 1 -4.293,2.8; 2 -4.293,2; 3 -4.293,1.2; 4 -4.293,0.4; 5 -4.293,-0.4; 6 -4.293,-1.2; 7 -4.293,-2; 8 -4.293,-2.8; 17 4.293,-2.8; 18 4.293,-2; 19 4.293,-1.2; 20 4.293,-0.4; 21 4.293,0.4; 22 4.293,1.2; 23 4.293,2; 24 4.293,2.8 | smd 0.559 x 1.27: 9 -2.8,-4.293; 10 -2,-4.293; 11 -1.2,-4.293; 12 -0.4,-4.293; 13 0.4,-4.293; 14 1.2,-4.293; 15 2,-4.293; 16 2.8,-4.293; 25 2.8,4.293; 26 2,4.293; 27 1.2,4.293; 28 0.4,4.293; 29 -0.4,4.293; 30 -1.2,4.293; 31 -2,4.293; 32 -2.8,4.293
LTC3536_ADJ_12PIN = smd 0.42 x 1.1: 1 -1.625,-2.2; 2 -0.975,-2.2; 3 -0.325,-2.2; 4 0.325,-2.2; 5 0.975,-2.2; 6 1.625,-2.2; 7 1.625,2.2; 8 0.975,2.2; 9 0.325,2.2; 10 -0.325,2.2; 11 -0.975,2.2; 12 -1.625,2.2 | smd 2.8 x 1.5: 13 0,0
SOT23-6 = smd 0.55 x 1.2: 1 0.95,1.3; 2 0,1.3; 3 -0.95,1.3; 4 -0.95,-1.3; 5 0,-1.3; 6 0.95,-1.3
PEM_2-56 = hole 3.734: 0,0
BASE328_SHIELD_1 = hole 3.734: 15.24,22.86; 38.1,3.81
MPXV6115VC6U = smd 2.54 x 1.524: 1 -8.382,3.81; 2 -8.382,1.27; 3 -8.382,-1.27; 4 -8.382,-3.81; 5 8.382,-3.81; 6 8.382,-1.27; 7 8.382,1.27; 8 8.382,3.81
PCB_HOLE = drill 3.175 pad 5.842: P$1 0,0 | hole 3.175: 0,0
ABRACON_ABM3-16.000MHZ-D2Y-T_OSCILLATOR = smd 1.9 x 2.4: P$1 -2.05,0; P$2 2.05,0
XBEE_PRO = drill 0.8 pad 1.27: 1 1.7,26.78; 2 1.7,24.78; 3 1.7,22.78; 4 1.7,20.78; 5 1.7,18.78; 6 1.7,16.78; 7 1.7,14.78; 8 1.7,12.78; 9 1.7,10.78; 10 1.7,8.78; 11 23.7,8.78; 12 23.7,10.78; 13 23.7,12.78; 14 23.7,14.78; 15 23.7,16.78; 16 23.7,18.78; 17 23.7,20.78; 18 23.7,22.78; 19 23.7,24.78; 20 23.7,26.78

### Placement (x,y rotation side)
5V  4.32,21.84 0 top
A0  24.38,64.52 90 top
A1  26.92,64.52 90 top
A2  29.46,67.06 90 top
A3  32,67.06 90 top
A6  47.24,67.06 90 top
AOUT  21.84,67.06 90 top
ARD.RST  10.67,50.55 90 top
BATT  31.5,59.88 270 top
BATTERY  62.17,12.32 0 top
BTRY  4.06,58.17 0 top
C1  45.21,46.74 180 top
C2  45.21,50.8 180 top
C3  19.05,61.98 0 top
C8  55.12,62.48 180 top
C11  64.07,49.78 270 top
C12  50.55,54.93 270 top
C90  35.81,48.13 180 top
C91  29.46,45.97 0 top
C92  29.59,36.2 90 top
C93  27.69,36.2 90 top
CSND5  103.63,57.72 90 top
D2  34.54,67.06 90 top
D3  37.08,67.06 90 top
D4  39.62,67.06 90 top
D5  42.16,67.06 90 top
D6  44.7,67.06 90 top
D.ASC  104.71,19.88 0 top
D.D13  2.79,31.88 180 top
D.PWR  2.79,33.15 180 top
D.RSSI  104.71,17.34 0 top
D.XON  104.71,18.61 0 top
EXTERN  90.42,62.74 180 top
F1  14.54,50.42 270 top
FTDI  16,61.98 90 top
GND  5.59,7.49 180 top
H.X1  100.58,53.59 180 top
H.X2  100.58,25.65 180 top
INPUT.PWR  4.19,50.67 0 top
INT1  38.35,33.27 180 top
ISP  39.62,28.19 270 top
J.D2  34.54,57.4 90 top
J.D3  37.08,57.4 90 top
J.D4  39.62,57.4 90 top
J.D5  42.16,57.4 90 top
J.D6  44.7,57.4 90 top
JBATT  22.35,25.91 90 top
JD3  87.25,31.37 270 top
JD4  101.28,60.96 90 top
JD13  4.32,28.96 180 top
JFTDIV  18.57,68.33 270 top
JINT  70.17,50.8 270 top
JINTSC  103.57,60.96 90 top
JMD  24.89,27.18 90 top
JON  12.7,54.86 0 top
JSHDN  30.35,25.78 270 top
JTMP  103,68.71 270 top
JVRR  49.78,73.41 90 top
JXRST  94.74,56.83 0 top
L1  21.21,39.24 90 top
PS2  97.6,74.55 270 top
PS3  100.08,74.55 270 top
PWR  14.48,4.57 0 top
PWR.EN  4.76,65.53 0 top
Q2  33.59,39.94 0 top
Q3  25.97,45.02 0 top
R1  19.05,60.83 0 top
R2  37.08,53.28 90 top
R3  74.93,60.39 0 top
R4  59.94,65.02 0 top
R5  59.94,63.75 0 top
R6  99.12,17.34 0 top
R7  99.12,19.88 0 top
R8  99.12,18.61 0 top
R9  39.62,53.28 90 top
R10  26.67,57.15 270 top
R11  34.54,53.28 90 top
R12  44.7,53.28 90 top
R13  42.16,53.28 90 top
R14  26.67,53.85 270 top
R15  43.37,35.31 180 top
R16  43.37,33.91 0 top
R17  50.04,68.33 90 top
R18  5.97,33.15 180 top
R19  50.8,65.79 180 top
R20  98.04,69.22 270 top
R25  5.97,31.88 180 top
R26  30.23,53.85 90 top
R27  30.23,57.15 90 top
R28  32.7,36.32 270 top
R90  26.29,48.13 180 top
R91  35.81,45.97 0 top
R92  29.46,48.13 0 top
R93  32.64,45.97 180 top
R94  32.64,48.13 180 top
RIN  21.78,44.2 180 top
RSSI  87.88,56.13 0 top
SHDN  27.43,27.18 270 top
SHLD  57.4,30.73 0 top
SLP  80.26,56.13 0 top
SW.COMMS  7.37,73.15 180 top
TMP  100.14,66.17 90 top
U1  57.4,52.32 0 top
U2  27.56,40.26 270 top
U3  56.13,65.02 90 top
U$1  [POLYCASE_WH_02]  53.21,38.73 0 top
U$2  [PEM_2-56]  12.57,26.29 0 top
U$8  [BASE328_SHIELD_1]  71.37,24.38 90 top
U$9  83.88,71.18 180 top
U$13  13.21,38.73 0 top
U$14  93.22,38.73 0 top
VCC  5.59,15.11 180 top
VCC2  5.59,4.95 180 top
VCR  3.05,10.03 0 top
VINF  5.59,12.57 180 top
VR  38.35,35.81 0 top
X1  48.51,48.77 90 top
XBEE  74.36,52.32 270 top
XCMSN  103.31,22.35 180 top
XCMSN1  103.12,25.65 0 top
XON  75.18,25.65 180 top
XRST  90.42,56.13 0 top
XSLP  83.25,56.13 180 top

### Tracks (layer width: path | path; a pad name or v marks a point on that pad's centre or on a via)
A0  (via drill 0.25)
  Top 0.254: v59.44,59.94 60.71,59.94 61.21,59.44 61.21,56.13 60.71,55.63 60.71,54.61 60.96,54.36 61.67,54.36 U1.23 | R14.1 R10.2 26.45,56.35 26.42,56.39 24.13,56.39 21.84,58.67 21.84,61.98 A0.1
  Bottom 0.254: A0.1 25.91,62.99 27.43,62.99 27.69,63.25 55.88,63.25 59.18,59.94 v59.44,59.94
A0.VD  (via drill 0.25)
  Top 0.254: v18.03,48.26 18.03,44.7 19.05,43.69 19.05,30.73 16.51,28.19 16.51,20.32 15.49,19.3 15.49,6.86 15.75,6.6 PWR.6 | v25.91,49.28 25.91,52.29 R14.2
  Bottom 0.254: v18.03,48.26 24.89,48.26 v25.91,49.28
A1  (via drill 0.25)
  Top 0.254: v45.21,27.88 44.32,28.77 44.45,31.78 R16.1 R15.2 | v67.56,30.73 v67.56,52.83 | v65.27,55.12 U1.24 61.72,55.15 61.72,59.69 60.71,60.71 v60.2,60.71
  Bottom 0.254: v45.21,27.88 67.56,27.88 v67.56,30.73 | A1.1 27.43,63.75 56.13,63.75 59.18,60.71 v60.2,60.71 | v65.27,55.12 v67.56,52.83
A1.VD
  Top 0.254: SHLD.2 44.07,33.91 R16.2
A2  (via drill 0.25, 0.25 pad 0.25)
  Top 0.254: v59.5,52.39 60.2,53.09 U1.25 60.2,58.16 v60.2,58.93 | SHLD.4 48.51,33.02 v53.34,37.85
  Bottom 0.254: v59.5,52.39 59.5,48.07 60.2,47.37 60.2,44.7 v53.34,37.85 | v60.2,58.93 60.96,59.69 60.96,61.21 60.71,61.47 59.44,61.47 56.64,64.26 32.26,64.26 A2.1
A3  (via drill 0.25, 0.25 pad 0.25)
  Top 0.254: v54.61,40.13 54.61,36.83 51.05,33.27 SHLD.6 | v58.74,51.88 58.74,52.58 59.4,53.24 U1.26 59.44,56.65 59.44,57.91 58.67,58.61 58.67,61.78 v59.44,62.74
  Bottom 0.254: v54.61,40.13 59.44,44.96 59.44,47.24 58.74,47.94 v58.74,51.88 | A3.1 32,66.29 33.53,64.77 57.4,64.77 v59.44,62.74
A4.SDA  (via drill 0.25)
  Top 0.254: 58.17,63.25 58.17,58.17 58.6,57.73 U1.27 58.6,54.68 v58.67,54.86 | 58.17,63.25 58.17,63.34 U3.4 | SHLD.12 58.67,33.27 60.2,34.8 v60.2,43.43 | R5.1 58.93,64.01 58.17,63.25
  Bottom 0.254: v60.2,43.43 60.96,44.2 60.96,52.71 v58.67,54.86
A5.SCL  (via drill 0.25 pad 0.25)
  Top 0.254: SHLD.14 61.21,32.77 61.72,33.27 v61.72,47.75 | v57.72,55.44 57.8,55.52 U1.28 57.8,57.77 57.66,57.91 57.66,62.48 56.39,63.75 56.39,64.77 56.64,65.02 U3.5 R4.1
  Bottom 0.254: v61.72,47.75 61.72,53.85 59.44,56.13 58.42,56.13 v57.72,55.44
A6
  Top 0.254: U1.19 57.33,51.12 55.63,52.83 55.63,54.1 53.85,55.88 53.85,60.71 50.04,64.52 50.04,66 R19.2 50.04,65.82 R17.1 47.71,67.53 A6.1
A6.IN  (via drill 0.25)
  Top 0.254: U$9.4 v80.84,74.99 | v51.31,69.09 51.27,69.13 R17.2
  Bottom 0.254: v80.84,74.99 73.72,74.99 72.64,73.91 72.64,69.6 71.37,68.33 53.09,68.33 52.32,69.09 v51.31,69.09
A7  (via drill 0.25)
  Top 0.254: 62.81,53.52 U1.22 63.43,53.52 63.75,53.85 v63.75,54.36 | BATT.1 v31.5,62.48
  Bottom 0.254: v31.5,62.48 31.75,62.74 55.12,62.74 59.18,58.67 63.63,54.48 v63.75,54.36
AOUT1  (via drill 0.25)
  Top 0.254: AOUT.1 23.11,68.33 30.23,68.33 30.73,68.83 30.73,70.36 31.24,70.87 v48.51,70.87 | U3.1 54.83,70.64 v54.61,70.87
  Bottom 0.254: v48.51,70.87 v54.61,70.87
BATTERY.VOLTAGE
  Top 0.254: R26.2 R27.1 31.5,57.62 BATT.2
D0.ARD.RX  (via drill 0.25)
  Top 0.254: v17.59,56.58 10.11,64.06 10.11,71.65 SW.COMMS.2 | v55.88,60.45 56.2,60.13 U1.30
  Bottom 0.254: v17.59,56.58 21.59,56.58 26.92,61.72 32,61.72 32.51,62.23 54.1,62.23 v55.88,60.45
D1.ARD.TX  (via drill 0.25)
  Top 0.254: SW.COMMS.5 6.16,70.1 8.38,70.1 9.4,69.09 9.4,63.75 v17.53,55.63 | v54.86,60.45 55.4,59.91 U1.31
  Bottom 0.254: v17.53,55.63 21.59,55.63 27.18,61.21 32.26,61.21 32.77,61.72 53.59,61.72 v54.86,60.45
D2.INT1  (via drill 0.25)
  Top 0.254: v56.9,43.94 v56.9,36.58 53.59,33.27 SHLD.8 | D2.1 J.D2.P$2 | v57.15,53.34 56.39,53.34 56.13,53.59 56.13,54.36 54.6,55.89 U1.32 v54.61,58.42 | INT1.1 39.69,34.61 v39.69,37.91 | JINT.3 70.17,48.83 v70.1,48.77
  Bottom 0.254: v56.9,43.94 57.15,44.2 v57.15,53.34 | J.D2.P$2 37.08,61.21 51.82,61.21 v54.61,58.42 | v56.9,36.58 69.09,48.77 v70.1,48.77 | v39.69,37.91 43.88,37.91 48.01,33.78 51.82,33.78 SHLD.8
D3.INT2  (via drill 0.25)
  Top 0.254: D3.1 J.D3.P$2 | JINT.1 69.14,51.61 v68.83,51.56 | SHLD.10 56.13,33.27 58.67,35.81 v58.67,40.13 58.67,45.09 v58.48,45.28 | JD3.1 87.25,40.77 80.01,48.01 v76.45,48.01 | v58.04,50.42 57.28,50.42 55.12,52.58 55.12,53.85 53.85,55.12 53.59,55.12 U1.1 53.11,56.11 v52.83,56.39
  Bottom 0.254: v58.67,40.13 68.83,50.29 v68.83,51.56 72.39,48.01 v76.45,48.01 | v58.04,50.42 58.04,45.72 v58.48,45.28 | v52.83,56.39 52.83,59.44 51.56,60.71 37.59,60.71 37.08,60.2 J.D3.P$2
D4  (via drill 0.25)
  Top 0.254: D4.1 J.D4.P$2 | XSLP.1 v84.84,56.13 | U1.2 52.36,54.32 52.07,54.61 v52.07,56.9 | JTMP.3 103,65.41 102.11,64.52 97.79,64.52 97.03,65.28 78.36,65.28 v74.96,61.88
  Bottom 0.254: D4.1 39.62,67.31 40.64,68.33 52.32,68.33 52.83,67.82 71.37,67.82 71.88,67.31 71.88,64.96 v74.96,61.88 75.37,61.47 81.53,61.47 EXTERN.8 84.84,58.17 v84.84,56.13 | v52.07,56.9 52.07,59.44 51.31,60.2 40.13,60.2 39.62,59.69 J.D4.P$2
D4.EXT  (via drill 0.25)
  Top 0.254: v93.22,61.47 93.47,61.47 93.98,60.96 JD4.2
  Bottom 0.254: v93.22,61.47 84.07,61.47 EXTERN.7
D5  (via drill 0.25)
  Top 0.254: D5.1 J.D5.P$2 43.43,57.4 v45.97,57.4 | U1.9 53.57,48.03 v53.59,48.01 53.59,46.23 52.58,45.21 52.58,41.4 52.57,38.09 47.24,32.77 47.24,30.73 SHLD.1 v45.97,15.75 | CSND5.1 v103.63,55.88 103.63,54.36 102.87,53.59 102.87,28.7 101.47,27.3 99.95,27.3 99.31,26.67 99.31,21.59 v98.81,21.08
  Bottom 0.254: v45.97,57.4 45.97,55.37 53.59,49.02 v53.59,48.01 | v98.81,21.08 93.47,15.75 v45.97,15.75 | v100.08,58.93 v100.08,55.63 103.5,55.63 v103.63,55.88
D6  (via drill 0.25)
  Top 0.254: Q2.G 32.7,39 R28.1 33.49,37.12 v33.84,37.15 | D6.1 J.D6.P$2 46.74,58.67 v46.74,55.63 | v55.4,50.01 U1.10 55.4,47.28 53.85,45.72 53.85,38.86 54.1,38.61 54.1,37.59 49.78,33.27 49.78,30.73 SHLD.3
  Bottom 0.254: v46.74,55.63 52.83,50.55 54.86,50.55 v55.4,50.01 | v33.84,37.15 38.35,37.15 | 38.35,37.15 43.88,37.15 47.24,33.78 47.24,30.73 SHLD.3 | VR.1 38.35,37.15
D7.ARD.SS.RX  (via drill 0.25)
  Top 0.254: SW.COMMS.8 11.62,73.15 13.08,73.15 13.59,72.64 13.59,70.74 10.67,67.82 10.67,64.52 v23.62,51.56 | v55.12,45.97 56.2,47.06 U1.11
  Bottom 0.254: v55.12,45.97 52.32,45.97 47.24,51.31 23.88,51.31 v23.62,51.56
D8.ARD.SS.TX  (via drill 0.25)
  Top 0.254: U1.12 57,46.59 v55.63,45.21 55.63,38.48 55.37,38.1 v55.37,37.34 | v22.99,50.8 19.05,54.74 17.4,54.74 8.89,63.25 8.89,68.83 8.13,69.6 4.83,69.6 3.37,71.06 3.37,73.4 SW.COMMS.11 | JTMP.1 101.23,69.52 100.77,69.98 99.47,69.98 98.71,69.22 97.54,69.22 94.11,65.79 77.72,65.79 66.55,54.61 v66.55,44.7
  Bottom 0.254: v55.63,45.21 52.32,45.21 46.99,50.8 v22.99,50.8 | v66.55,44.7 66.29,44.7 57.4,35.81 56.52,35.81 55.37,36.96 v55.37,37.34
D9  (via drill 0.25)
  Top 0.254: U1.13 57.8,46.37 56.2,44.77 56.2,37.15 52.32,33.27 52.32,30.73 SHLD.5 v51.05,18.29 | JXRST.1 93.93,54.91 94.23,54.61 94.23,52.96 94.14,52.8 94.14,49.53 75.95,49.53 74.42,48.01 74.42,30.73 69.6,25.91 69.6,23.11 v64.77,18.29
  Top 0.305: v41.28,8.51 v51.05,18.29
  Bottom 0.254: v64.77,18.29 v51.05,18.29
  Bottom 0.305: v41.28,8.51 20.95,8.51 PWR.8
D10.SS
  Top 0.254: U1.14 58.6,46.48 57.78,45.66 57.78,36.2 54.86,33.27 54.86,30.73 SHLD.7
D11.MOSI  (via drill 0.25)
  Top 0.254: U1.15 59.4,35.27 57.4,33.27 57.4,30.73 SHLD.9 v53.85,27.18
  Bottom 0.254: ISP.4 41.4,27.69 44.26,27.69 44.77,27.18 v53.85,27.18
D12.MISO  (via drill 0.25)
  Top 0.254: U1.16 60.2,48 61.21,46.99 61.21,34.54 59.94,33.27 59.94,30.73 SHLD.11 v55.63,26.42
  Bottom 0.254: v55.63,26.42 44.7,26.42 44.2,26.92 40.13,26.92 39.62,27.43 39.62,29.46 ISP.1
D13.EXT
  Top 0.254: EXTERN.9 78.99,61.47 76.77,61.47 75.73,60.43 R3.2
D13.SCK  (via drill 0.25)
  Top 0.254: U1.17 61.72,49.5 61.72,49.09 62.99,47.82 v62.99,46.74 62.99,33.53 62.48,33.02 62.48,30.73 SHLD.13 v58.17,26.42 | v32.77,18.8 v32.77,24.38 v32.77,28.19 | v72.96,56.71 72.96,60.07 73.28,60.39 R3.1
  Bottom 0.254: v58.17,26.42 57.4,25.65 43.94,25.65 42.67,24.38 v32.77,24.38 | v72.96,56.71 v62.99,46.74 | JD13.P$1 5.59,27.43 17.27,18.8 v32.77,18.8 | v32.77,28.19 ISP.3
EXT.ASC  (via drill 0.25)
  Top 0.254: EXTERN.5 86.61,61.47 v86.61,58.93 | v88.14,48.01 100.97,48.01 v101.98,49.02 | v103.89,49.02 103.89,28.96 104.65,28.19 104.65,24.64 104.39,24.38 104.39,20.34 D.ASC.1 R7.2
  Bottom 0.254: v86.61,58.93 86.61,52.83 88.14,51.31 v88.14,48.01 | v101.98,49.02 v103.89,49.02
FTDI.RX
  Top 0.254: SW.COMMS.12 3.4,75.44 4.83,75.44 5.37,74.9 5.37,72.87 6.33,71.9 SW.COMMS.4
  Bottom 0.254: SW.COMMS.4 6.37,69.96 11.94,64.52 FTDI.2
FTDI.TX
  Top 0.254: SW.COMMS.1 12.05,71.9 10.8,73.15 9.62,73.15 SW.COMMS.9
  Bottom 0.254: FTDI.3 14.73,67.06 | 12.11,71.71 SW.COMMS.1
  Bottom 0.305: 12.11,71.71 12.11,69.68 14.73,67.06
GND  (via drill 0.25, 0.5, 0.6)
  Top 0.254: U2.13 26.58,41.23 U2.2 23.94,41.23 RIN.2 | 54.61,52.32 54.61,53.09 54.17,53.52 U1.3 52.39,53.52 51.56,54.36 51.56,55.37 51.43,55.51 C12.1 49.41,56.64 48.77,56.64 46.17,54.04 46.17,52.45 46.14,52.48 R12.1 | 54.61,52.32 54.21,51.92 U1.5 | C92.1 v28.19,33.9 | R15.1 43.92,35.59 43.18,36.32 41.53,36.32 v41.53,34.54 41.53,32.89 43.18,31.24 v43.18,26.16 | 32.77,35.46 32.87,35.46 v33.78,34.54 | EXTERN.4 87.88,59.94 v89.15,58.86 | 91.69,72.9 U$9.3 | JINTSC.3 JD4.3 100.03,61.77 v99.19,62.61 98.3,63.5 v95.76,63.5 | R92.1 28.66,48.3 27.69,49.02 26.67,49.02 26.16,48.51 26.16,48.01 25.62,48.01 R90.2 25.27,48.13 24.38,49.02 v24.13,49.02 24.35,49.02 | RIN.2 20.07,44.2 v19.3,44.96 | RIN.2 20.98,48.92 v21.08,49.02 | R19.1 52.83,65.79 | 52.83,65.79 53.59,65.02 U3.2 55.63,65.02 55.88,64.77 | C8.1 55.92,64.73 55.88,64.77 | U3.6 56.32,65.97 55.88,65.53 55.88,64.77 | v52.83,69.6 52.83,65.79 | U2.5 23.54,39.28 v23.37,39.12 | XCMSN.3 101.56,23.11 v100.14,23.11 | D.ASC.2 D.XON.2 D.RSSI.2 105.51,16.48 105.41,16.26 v100.14,16.26 100.84,13.21 101.5,12.55 BATTERY.2 | v99.06,30.86 99.06,45.97 97.79,47.24 v86.49,47.24 | ARD.RST.1 9.87,46.57 v8.26,44.96 | U1.21 61.11,52.72 v60.26,51.88 | v60.26,49.66 57.28,49.66 54.61,52.32
  Top 0.305: GND.2 GND.1 | U$9.3 92.2,72.52 v90.11,72.52
  Top 0.406: 32.77,35.46 R28.2 | v25.15,33.9 v25.15,36.58 27.56,38.99 U2.13
  Top 0.61: GND.1 7.43,9.33 v7.43,11.18
  Bottom 0.254: 77.72,58.67 H.X1.10 80.69,50.62 XBEE.10 83.2,50.53 v86.49,47.24 | v43.18,26.16 41.4,26.16 ISP.6 | v33.78,34.54 v41.53,34.54 | v89.15,58.86 94.93,58.86 95.76,59.69 v95.76,63.5 95.76,67.31 | 74.23,58.74 74.17,58.67 | v21.08,49.02 v24.13,49.02 | v52.83,69.6 51.94,69.6 51.69,69.85 50.93,69.85 50.67,69.6 A6.2 D6.2 D5.2 D4.2 D3.2 D2.2 A3.2 A2.2 A1.2 A0.2 AOUT.2 17.78,73.66 17.02,73.66 FTDI.6 | v25.15,33.9 v28.19,33.9 | v23.37,39.12 23.37,38.35 v25.15,36.58 | v100.14,16.26 v100.14,23.11 99.31,24 99.31,27.18 100.14,28 100.14,29.34 99.06,30.42 v99.06,30.86 | TMP.1 100.14,63.56 v99.19,62.61 | v8.26,44.96 v12.45,44.96 | EXTERN.6 EXTERN.4 | v60.26,51.88 v60.26,49.66
  Bottom 0.305: v90.11,72.52 90.55,72.52 95.76,67.31
  Bottom 0.406: v69.09,58.67 74.17,58.67 77.72,58.67 80.26,58.67 EXTERN.10
  Bottom 0.61: v12.45,44.96 v19.3,44.96 | BTRY.2 2.49,57.86 INPUT.PWR.2
  Bottom 0.813: v12.32,11.18 v7.43,11.18
  other vias: 26.92,28.96 20.95,29.34
  pour Top: -4.57,80.26 109.47,80.26 109.47,-2.29 -4.57,-2.29
INT.SRC
  Top 0.254: EXTERN.11 79.76,64.77 95.76,64.77 96.52,64.01 103.12,64.01 104.65,62.48 104.65,61.21 104.39,60.96 JINTSC.2
INT.SRC.IN
  Top 0.254: JINT.2 71.12,50.8 71.37,51.05 71.37,53.85 EXTERN.12
N$1
  Top 0.254: U1.7 50.51,50.32 50.02,50.82 X1.P$2 46.03,50.82 C2.1
N$2
  Top 0.254: U1.8 50.54,49.52 49,46.72 X1.P$1 46.03,46.72 C1.1
N$3
  Top 0.254: FTDI.1 C3.1
N$4
  Top 0.61: 21.84,12.95 22.48,12.32 BATTERY.1 22.84,13.18 22.86,13.21 22.86,21.34 20.83,23.37 20.83,25.91 22.1,27.18 JBATT.P$2
N$5
  Top 0.254: D.D13.1 R25.2
N$6
  Top 0.254: JD13.P$2 3.56,28.96 5.33,30.73 5.63,30.73 R25.1
N$7
  Top 0.254: JTMP.2 TMP.2 99.85,68.42 R20.2
N$12
  Top 0.254: U2.4 23.31,39.93 22.73,40.52 L1.P$2
N$13
  Top 0.254: PS3.1 PS2.1 96.27,75 96.27,73.41 92.77,69.91 U$9.2
N$16
  Top 0.254: D.PWR.1 R18.2
N$20
  Top 0.254: J.D3.P$1 R2.2
N$21
  Top 0.254: J.D6.P$1 R12.2
N$22
  Top 0.254: J.D5.P$1 R13.2
N$23
  Top 0.254: U2.6 24.69,37.97 L1.P$1
N$24
  Top 0.254: D.RSSI.1 R6.2
N$25
  Top 0.254: J.D2.P$1 R11.2
N$26
  Top 0.254: R90.1 27.69,47.28 27.69,45.21 27.94,44.96 27.94,43.43 26.39,41.88 U2.1
N$27
  Top 0.254: U2.11 29.12,41.23 28.7,41.66 28.7,45.94 C91.1 28.66,46.28 R92.2 R94.2 32.73,49.02 34.54,49.02 35.01,48.55 C90.2
N$28
  Top 0.254: C90.1 R91.2
N$29  (via drill 0.25 pad 0.25)
  Top 0.254: U2.12 29.76,43.48 v30.99,44.7 | v35.05,44.96 35.01,44.92 R91.1
  Bottom 0.254: v30.99,44.7 34.8,44.7 v35.05,44.96
N$30
  Top 0.254: C91.2 R93.2
N$31
  Top 0.254: U2.3 23.42,40.58 22.35,41.66 20.07,41.66 19.81,41.4 19.81,36.32 20.95,35.18 20.95,31.11 JMD.P$2
N$33
  Top 0.254: D.XON.1 R8.2
N$34
  Top 0.254: J.D4.P$1 R9.2
RESET  (via drill 0.25)
  Top 0.254: C3.2 R1.2 19.81,60.8 v19.81,58.17 | v8.89,58.17 8.89,51.02 ARD.RST.4 11.47,46.57 11.43,46.54 7.24,42.35 7.24,37.15 12.38,32 v17.15,32 | v54.61,51.31 54.61,49.53 53.85,48.77 53.34,48.77 52.07,47.5 52.07,38.35 50.04,36.32 46.99,36.32 45.47,37.85 41.91,37.85 40.77,36.7 40.77,32.89 42.42,31.24 42.42,25.15 41.4,24.13 39.88,24.13 ISP.5 v38.35,20.07 | v56.9,54.61 57,54.72 U1.29 | v34.29,25.65 v34.29,32 | v67.82,20.07 70.1,22.35 70.1,25.65 75.18,30.73 75.18,48.01 75.95,48.77 96.14,48.77 96.14,51.37 96.77,51.94 96.77,54.29 95.56,55.51 JXRST.3
  Bottom 0.254: v8.89,58.17 v19.81,58.17 | v34.29,25.65 ISP.5 | v54.61,51.31 54.61,52.32 v56.9,54.61 | v34.29,32 v17.15,32 | v67.82,20.07 v38.35,20.07
RSSI  (via drill 0.25)
  Top 0.254: R6.1 92.52,17.34 91.69,16.76 86.36,16.76 81.53,21.59 81.53,27.18 80.77,27.94 80.77,29.21 85.09,33.53 v85.09,41.15 | RSSI.1 H.X1.6
  Bottom 0.254: v85.09,41.15 85.09,42.16 91.2,48.28 XBEE.6 88.23,53.59 H.X1.6
SHDN  (via drill 0.25)
  Top 0.254: v31.75,27.18 31.75,40.39 31.55,40.58 U2.10
  Top 0.406: SHDN.2 29.66,24.64 JSHDN.2
  Bottom 0.254: SHDN.2 SHDN.1 v31.75,27.18
VCC  (via drill 0.25)
  Top 0.254: Q2.D 34.23,41.46 34.23,45.34 33.59,45.97 R93.1 R94.1 | SHLD.15 65.02,30.73 65.02,32.77 63.75,34.04 63.75,48.01 62.99,48.77 62.99,49.78 62.45,50.32 U1.18 64.03,50.32 C11.1 64.07,51.24 63.39,51.92 | U1.20 63.39,51.92 | A6.4 D6.4 D5.4 D4.4 D3.4 D2.4 A3.4 A2.4 A1.4 A0.4 AOUT.4 19.81,72.64 19.81,68.29 JFTDIV.P$2 | R1.1 18.25,59.14 v18.03,58.93 17.02,58.93 14.69,61.29 | Q2.D 33.34,40.83 | v33.53,42.16 33.53,40.89 Q2.D | R4.2 R5.2 v62.23,63.75 | 105.66,60.2 105.36,60.15 JINTSC.1 JD4.1 | 51.82,52.83 50.55,53.85 C12.2 50.3,54.35 v49.02,55.63 | 51.82,52.83 51.92,52.72 U1.4 | U1.6 52,51.12 51.82,51.31 51.82,52.83 | v16,54.86 v11.94,58.93 | 63.39,51.92 64.37,51.92 v65.02,52.58 | C93.2 27.43,37.08 | H.X1.1 101.14,53.13 XBEE.1 | 14.57,61.4 14.69,61.29 | v7.62,27.05 7.62,32.77 7.24,33.15 R18.1 | ISP.2 40.26,31.37 40.26,37.02 40.51,37.28 40.51,38.29 v37.85,40.96 | v14.54,65.79 14.54,61.44 14.69,61.29
  Top 0.406: U2.7 29.23,38.63 C93.2 | v104.14,53.59 105.66,55.12 105.66,60.2 105.66,73.79 | v26.42,34.8 26.42,36.07 27.43,37.08 | v19.94,34.8 v19.94,29.72 17.27,27.05 17.27,9.27 19.69,6.86 19.69,4.7 PWR.7
  Bottom 0.254: v11.94,58.93 v18.03,58.93 | v37.85,40.96 36.64,42.16 v35.81,42.16
  Bottom 0.406: H.X1.1 v104.14,53.59 | VCC.1 VCC.2 | v26.42,34.8 v19.94,34.8 | v19.94,29.72 19.94,24.26 20.83,23.37 23.62,23.37 JMD.P$1
  other vias: 34.29,46.99 20.07,42.93 18.54,51.05 103.63,71.88 69.09,45.47
  pour Bottom: -6.35,82.04 111,82.04 111,-4.83 -6.35,-4.83
VCC2  (via drill 0.25)
  Top 0.254: PS2.2 97.6,72.84 v95.88,71.12 | v83.98,76.17 28.42,76.17 A1.5 A0.5 22.54,76.52 2.35,76.52 1.14,75.31 1.14,54.48 4.32,51.31 4.32,48.26 4.83,47.75 4.83,36.96 8.38,33.4 8.38,24.13 8.51,24 8.51,7.87 VCC2.1
  Top 0.305: VCC2.1 VCC2.2
  Top 0.406: SHLD.20 70.36,30.48 70.36,28.96 69.34,27.94 68.58,27.94 v48.13,7.37
  Bottom 0.254: v83.98,76.17 90.27,76.17 91.44,74.93 95.25,71.12 v95.88,71.12
  Bottom 0.406: v48.13,7.37 31.12,7.37 25.15,1.4 15.11,1.4 PWR.3 11.81,1.91 9.91,1.91 6.86,4.95 VCC2.1
VCC.FTDI
  Bottom 0.254: JFTDIV.P$1 FTDI.4
VIN.F  (via drill 0.25)
  Top 0.254: U2.9 29.81,39.88 | PWR.5 17.02,4.57 17.02,8.51 16.38,9.14 v16.38,14.1
  Top 0.305: VINF.1 VINF.2
  Top 0.406: C92.2 30.73,37.08 30.99,36.83 | 30.99,36.83 30.99,34.54 v30.48,34.04 30.35,33.91 JSHDN.1 31.5,26.23 v31.5,23.37 v31.5,19.56 | v18.29,32.77 18.29,43.43 17.27,44.45 17.27,45.21 14.48,48.01 14.48,48.86 F1.P$2 14.58,48.92 | 30.99,39.37 30.99,39.88 30.93,39.93 U2.9 | 30.99,39.37 30.99,36.83 | U2.8 30.9,39.28 30.99,39.37 | v18.16,15.88 v21.84,19.56 | SHLD.19 v63.75,24.38
  Bottom 0.406: v18.29,32.77 29.21,32.77 v30.48,34.04 | v21.84,19.56 v31.5,19.56 | v63.75,24.38 44.45,24.38 42.67,22.61 34.8,22.61 34.04,23.37 v31.5,23.37 | VINF.1 14.86,12.57 v16.38,14.1 v18.16,15.88
VIN.PWR  (via drill 0.25)
  Top 0.254: R26.1 30.23,52.58 v29.72,52.07 | v23.69,52.58 20.57,55.69 v20.57,57.4 | EXTERN.1 91.95,61.21 91.95,59.69 89.92,57.66 77.98,57.66 73.91,53.59 73.91,30.99 69.09,26.16 69.09,23.88 v66.29,21.08 | 23.11,45.97 23.11,48.13 21.46,49.78 15.88,49.78 15.11,50.55 13.46,50.55 12.95,51.05 12.95,53.34 JON.P$1 | PWR.EN.5 4.76,58.74 BTRY.1
  Top 0.406: Q3.D 25.9,45.97 23.11,45.97 v23.05,45.91 | JBATT.P$1 22.35,23.62 v25.4,20.57 | SHLD.17 v57.91,21.08 | INPUT.PWR.1 v5.99,45.97 5.99,36.74 9.14,33.59 9.14,24.64 9.65,24.13 v9.65,22.99 9.65,18.54 v11.43,16.76 9.14,14.48 9.14,4.83 PWR.1 | 5V.VBUS 7.17,23.93 v7.37,24.13
  Bottom 0.254: v29.72,52.07 24.19,52.07 v23.69,52.58
  Bottom 0.406: v20.57,57.4 11.43,57.4 | 11.43,57.4 6.1,57.4 BTRY.1 | 34.04,20.57 37.08,20.57 37.85,21.08 v57.91,21.08 v66.29,21.08 | v11.43,16.76 34.04,16.76 34.04,20.57 | v25.4,20.57 34.04,20.57 | v5.99,45.97 5.99,45.91 v23.05,45.91 21.91,45.91 | JON.P$1 11.43,57.4 | v7.37,24.13 8.51,24.13 v9.65,22.99
VIN.PWR2
  Top 0.254: Q3.S 26.92,46.48 26.42,46.99 25.15,46.99 21.84,50.29 16.17,50.29 F1.P$1
  Top 0.406: JON.P$2 13.97,52.49 F1.P$1
VIN.PWR.EN  (via drill 0.25)
  Top 0.254: EXTERN.2 90.42,58.93 89.66,58.17 77.72,58.17 73.41,53.85 73.41,31.24 v65.79,23.62 | v33.53,21.84 v33.53,31.24 | v12.38,31.24 6.6,37.02 6.6,45.47 v7.87,46.74 7.87,52.2 7.26,52.81 PWR.EN.4
  Top 0.305: Q3.G 23.94,44.14 v23.88,44.2 RIN.1
  Bottom 0.254: v65.79,23.62 45.21,23.62 43.43,21.84 v33.53,21.84 | v33.53,31.24 v12.38,31.24
  Bottom 0.305: v7.87,46.74 23.62,46.74 23.88,46.48 v23.88,44.2
VRR  (via drill 0.25)
  Top 0.254: v62.48,28.57 v60.33,26.42 | v35.05,23.62 35.05,32.26 34.54,32.77 34.54,33.53 Q2.S 38.35,42.87 38.35,48.51 v36.83,50.04 | v25.15,50.04 25.15,52.32 21.34,56.13 21.34,64.01 20.32,64.77 20.32,70.61 AOUT.3 A0.3 A1.3 A2.3 A3.3 D2.3 D3.3 D4.3 D5.3 D6.3 A6.3 JVRR.P$1 52.07,72.14 | PS3.2 100.08,73.41 99.19,72.52 | 99.19,72.52 98.04,71.37 | 98.04,71.37 95.25,68.58 73.91,68.58 70.36,72.14 52.07,72.14 | C8.2 54.83,63 U3.3 51.75,64.07 50.8,65.02 50.8,66.55 52.07,67.82 52.07,72.14 | v39.12,13.46 v39.12,23.62 | R20.1 98.04,71.37 | TMP.3 100.14,71.56 99.19,72.52
  Top 0.305: VCR.1 VCR.2
  Top 0.406: PWR.2 v10.67,9.91
  Top 0.61: Q2.S
  Bottom 0.254: SHLD.16 62.48,30.73 v62.48,28.57 | v60.33,26.42 59.12,25.15 44.45,25.15 42.93,23.62 v39.12,23.62 v35.05,23.62 | v36.83,50.04 v25.15,50.04 | 21.84,9.91 35.56,9.91 v39.12,13.46
  Bottom 0.406: VCR.2 6.48,10.03 PWR.2 | v10.67,9.91 21.84,9.91
XBEE2.DO
  Bottom 0.254: SW.COMMS.3 9.36,73.15 11.05,73.15 12.3,74.4 SW.COMMS.7 12.37,75.87 13.02,76.52 82.26,76.52 83.31,75.47 90.17,75.47 90.19,75.45 97.28,68.33 97.28,54.36 H.X1.2 98.04,51.78 XBEE.2
XBEE3.DI  (via drill 0.25)
  Top 0.254: SW.COMMS.10 6.58,74.4 8.13,75.95 17.02,75.95 17.53,75.44 v18.67,75.44
  Bottom 0.254: v18.67,75.44 19.18,75.95 82.14,75.95 83.12,74.96 89.88,74.96 96.77,68.07 96.77,54.86 H.X1.3 97.2,51.9 XBEE.3 | SW.COMMS.10 4.86,73.15 3.36,73.15 SW.COMMS.6
XBEE4
  Bottom 0.254: H.X1.4 95.2,51.36 XBEE.4
XBEE5.RST
  Top 0.254: H.X1.5 XRST.1 90.42,56.9 91.95,58.42 94.49,58.42 94.74,58.17 JXRST.2
  Bottom 0.254: H.X1.5 93.2,50.82 XBEE.5
XBEE9
  Top 0.254: H.X1.9 80.52,53.59 82.04,52.07 83.76,52.07 XBEE.9
  Top 0.305: XSLP.2 SLP.1 H.X1.9
XBEE11
  Bottom 0.254: XBEE.11 80.69,28.62 H.X2.10
XBEE12
  Bottom 0.254: H.X2.9 82.04,27.43 84.01,27.43 XBEE.12
XBEE13
  Top 0.254: XBEE.13 87.2,30.87 JD3.2 | R8.1 93.28,18.61 91.44,17.27 86.61,17.27 82.8,21.08 H.X2.8
  Bottom 0.254: XON.2 XON.1 76.71,24.13 81.28,24.13 H.X2.8 83.25,25.65 84.77,27.18 85.76,27.18 XBEE.13
XBEE14
  Bottom 0.254: XBEE.14 87.69,27.11 86.8,27.11 H.X2.7
XBEE15
  Top 0.254: R7.1 93.66,19.88 92.71,20.83 92.71,21.72 90.87,23.56 89.98,23.56 H.X2.6
  Bottom 0.254: XBEE.15 88.23,25.65 H.X2.6
XBEE16
  Bottom 0.254: XBEE.16 90.42,25.85 H.X2.5
XBEE17
  Bottom 0.254: XBEE.17 92.96,26.39 H.X2.4
XBEE18
  Bottom 0.254: XBEE.18 95.5,26.93 H.X2.3
XBEE19
  Bottom 0.254: XBEE.19 98.04,27.47 H.X2.2
XBEE20  (via drill 0.25)
  Top 0.254: EXTERN.3 89.41,64.26 93.73,64.26 95.5,62.48 97.79,62.48 v98.55,61.72 | XBEE.20 v101.2,45.96 | XCMSN.2 103.34,21.55 103.89,22.1 103.89,24.89 XCMSN1.1 | CSND5.2 v99.32,58.17 v99.31,58.17
  Bottom 0.254: v98.55,61.72 99.31,60.96 v99.31,58.17 99.31,52.83 100.14,52.01 100.14,49.85 101.2,48.79 v101.2,45.96 | XBEE.20 101.2,26.27 H.X2.1 XCMSN1.1

### Text on the board
tPlace: GND | D8 | V+ | D4 | INT | D13 | D4 | ASC | XCMS | PWR.EN | GND | G | G | G | VCC | _ | D9 | RST | + | D3 | D2 | _ | + | R003 | + | -
tOrigins: OFF | ON
tNames: XB | PRG | PRESSURE | D.PWR | A1.VD | A2 | A3 | D2 | D3 | A4 | A5 | VRR | GND | VCC2 | D.D13 | D5 | D6 | D9 | D10 | D11 | D12 | D13 | VCC | VINF | VIN.PWR | XCMSN | VRR | GND | A0.VD | D9 | V+ | GND | VIN.PWR | VCC2 | VIN.F | VCC
tTest: Make terminal and battery same size
tDocu: .275 inches from inside of enclosure / to center of pin 1